# EasyEDA Pro project ProPrj_STM32_Balance_Car.epro

# Schematic Schematic1

## Sheets
1 电源: Board Name: Board1; Create Date: 2025-04-29; Page Name: 电源; Project Name: STM32_Balance_Car; Schematic Name: Schematic1; Update Date: 2025-05-03; Company: 嘉立创EDA; Page Size: A4; Version: V1.0
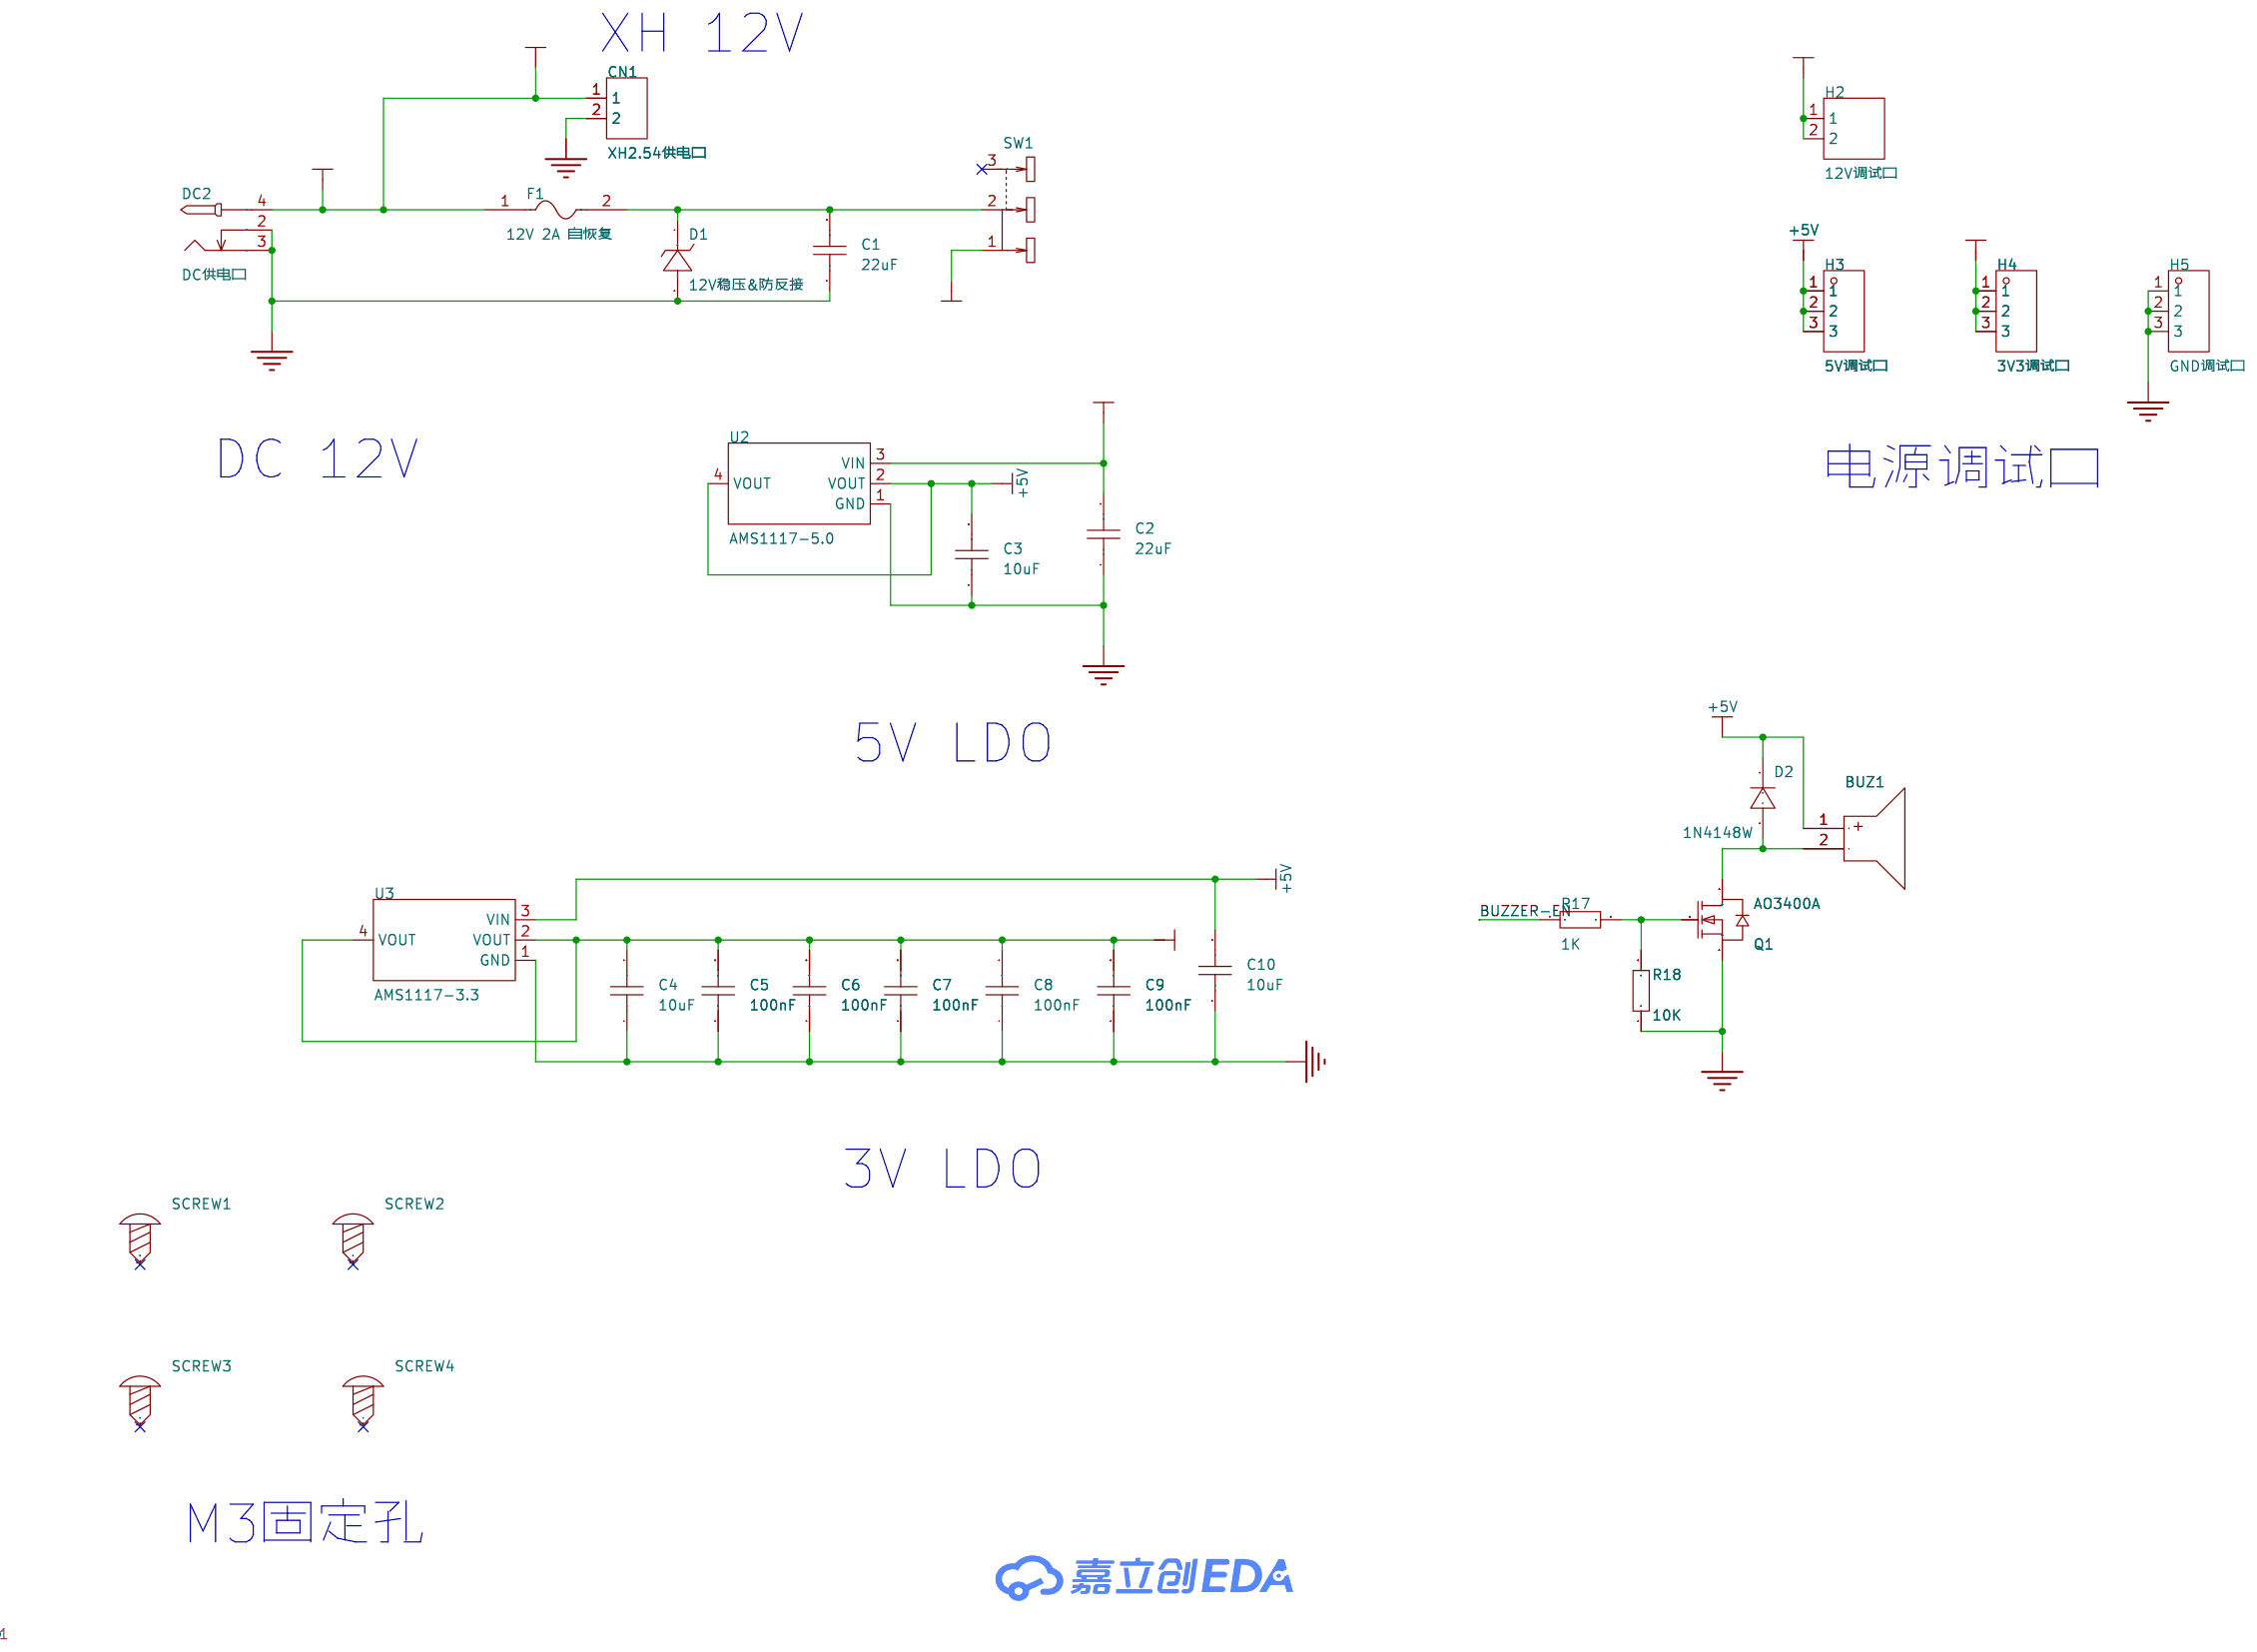
[diagram p0: 电源]
2 MCU: Page Name: MCU
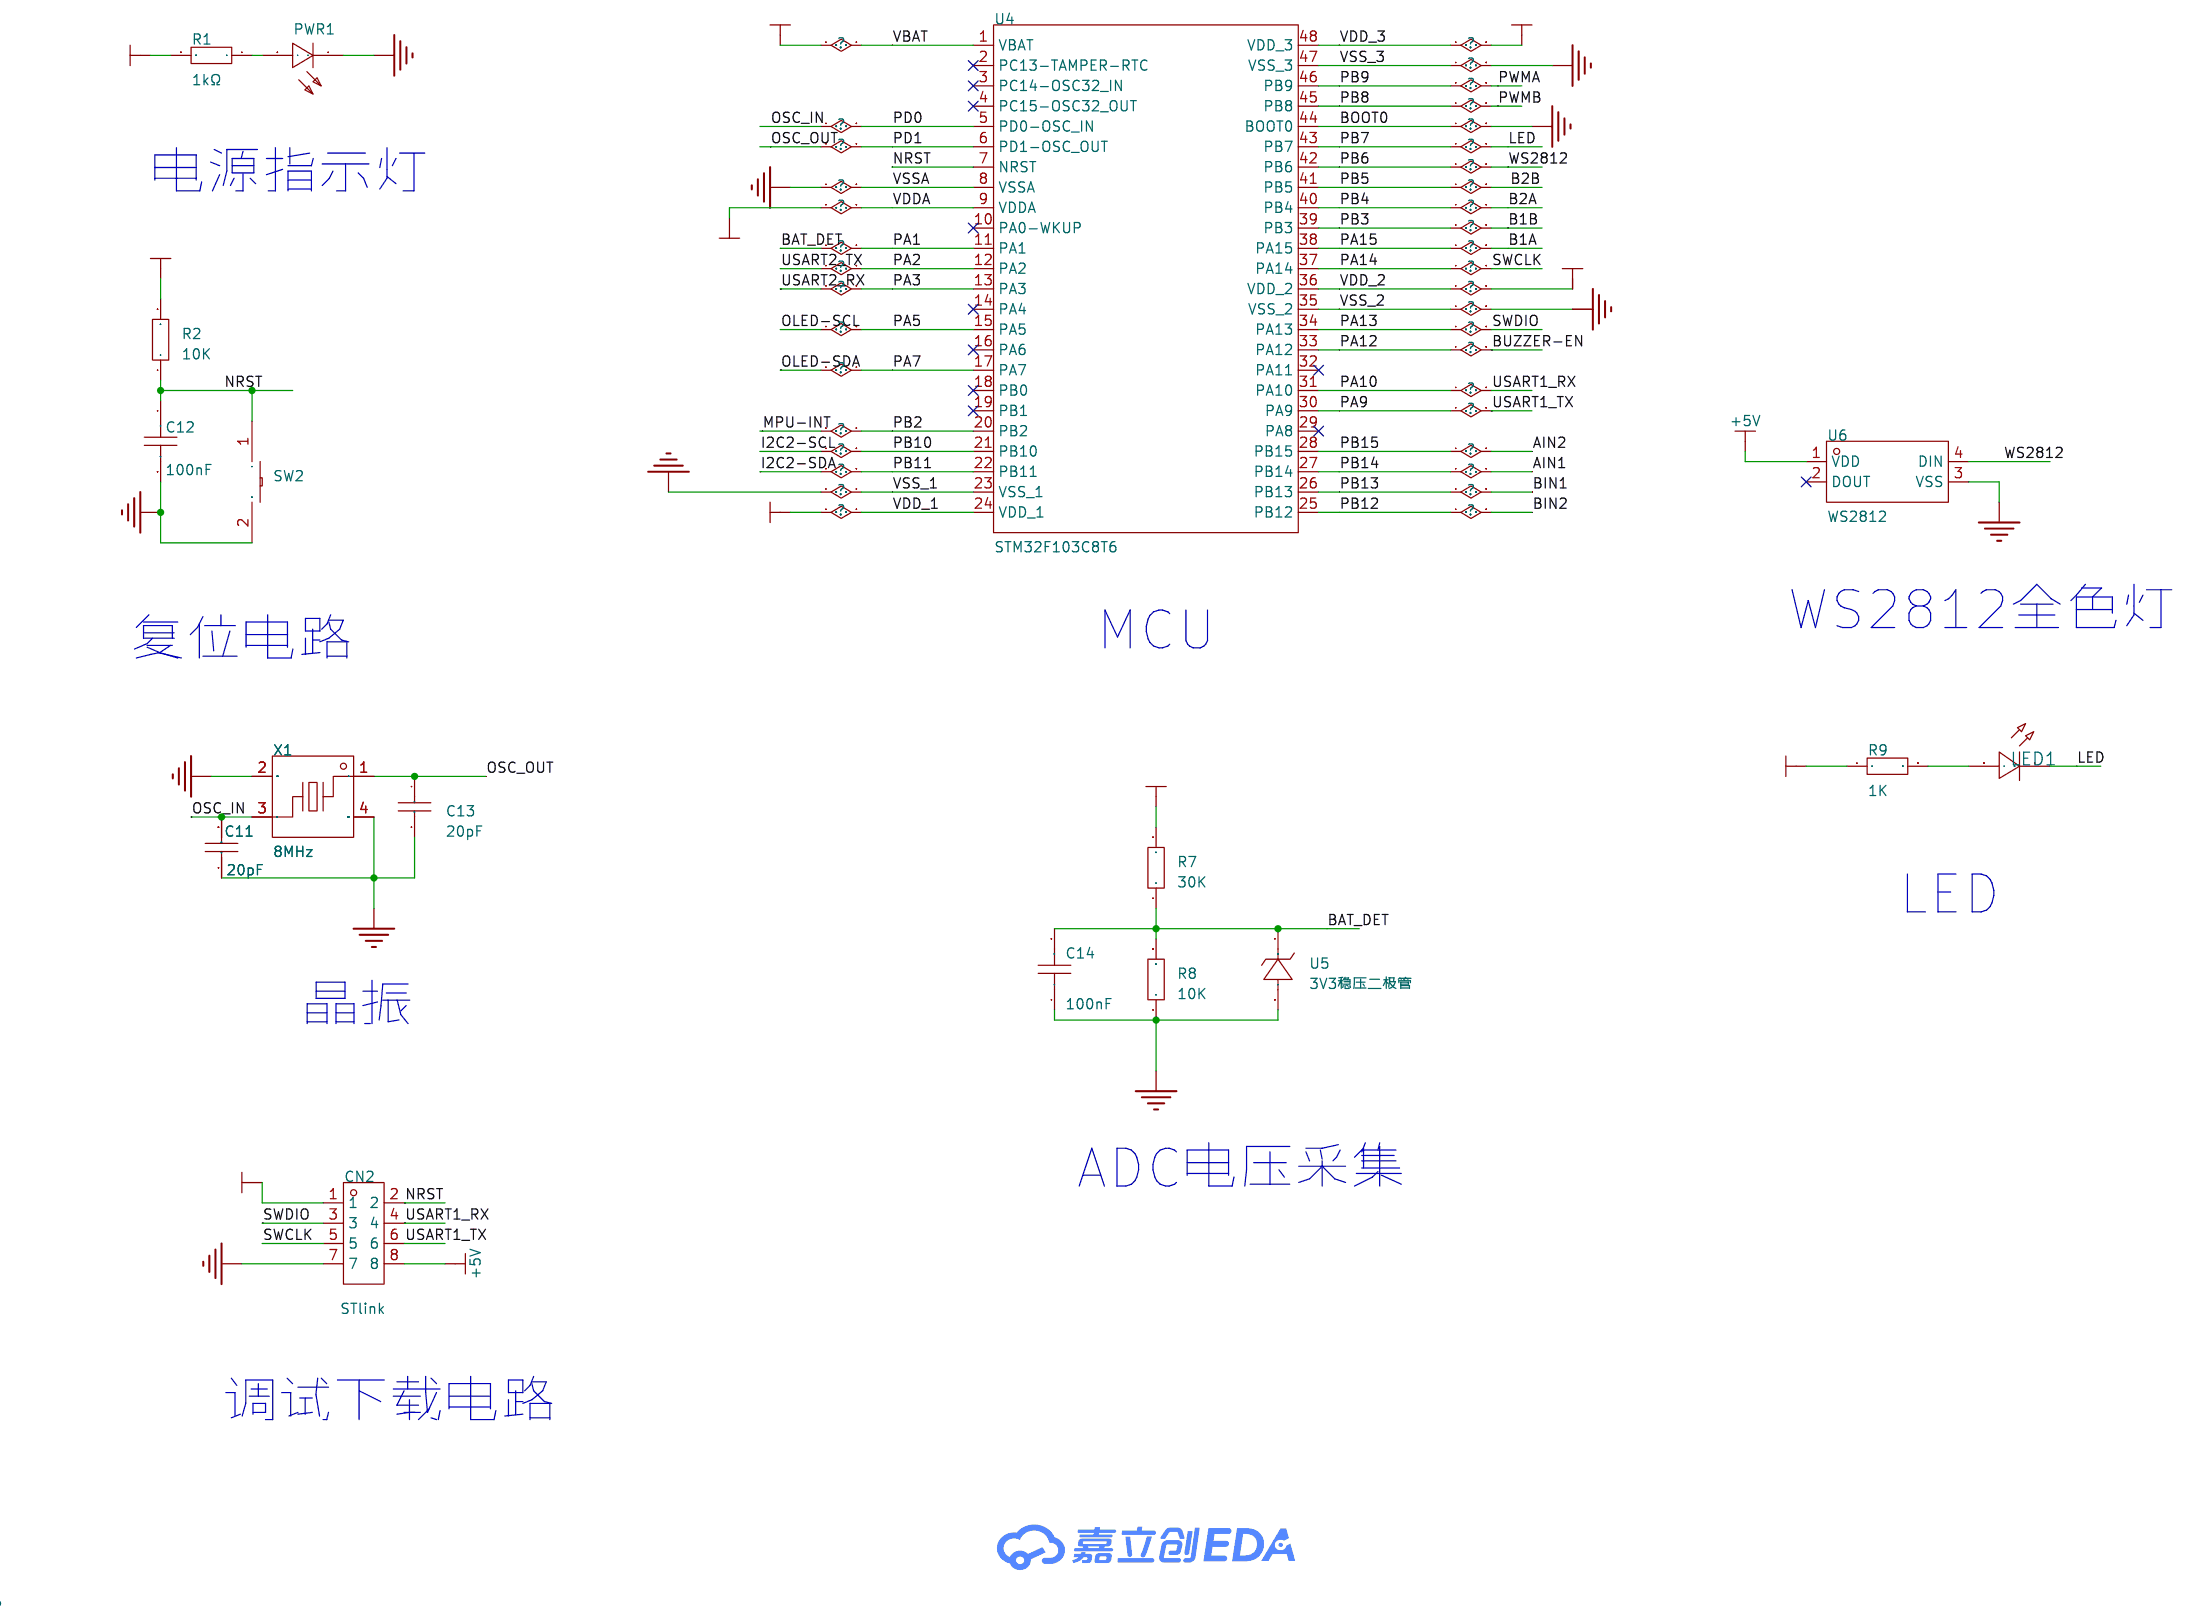
[diagram p1: MCU]
3 电机驱动: Create Date: 2025-04-30; Page Name: 电机驱动; Update Date: 2025-05-04
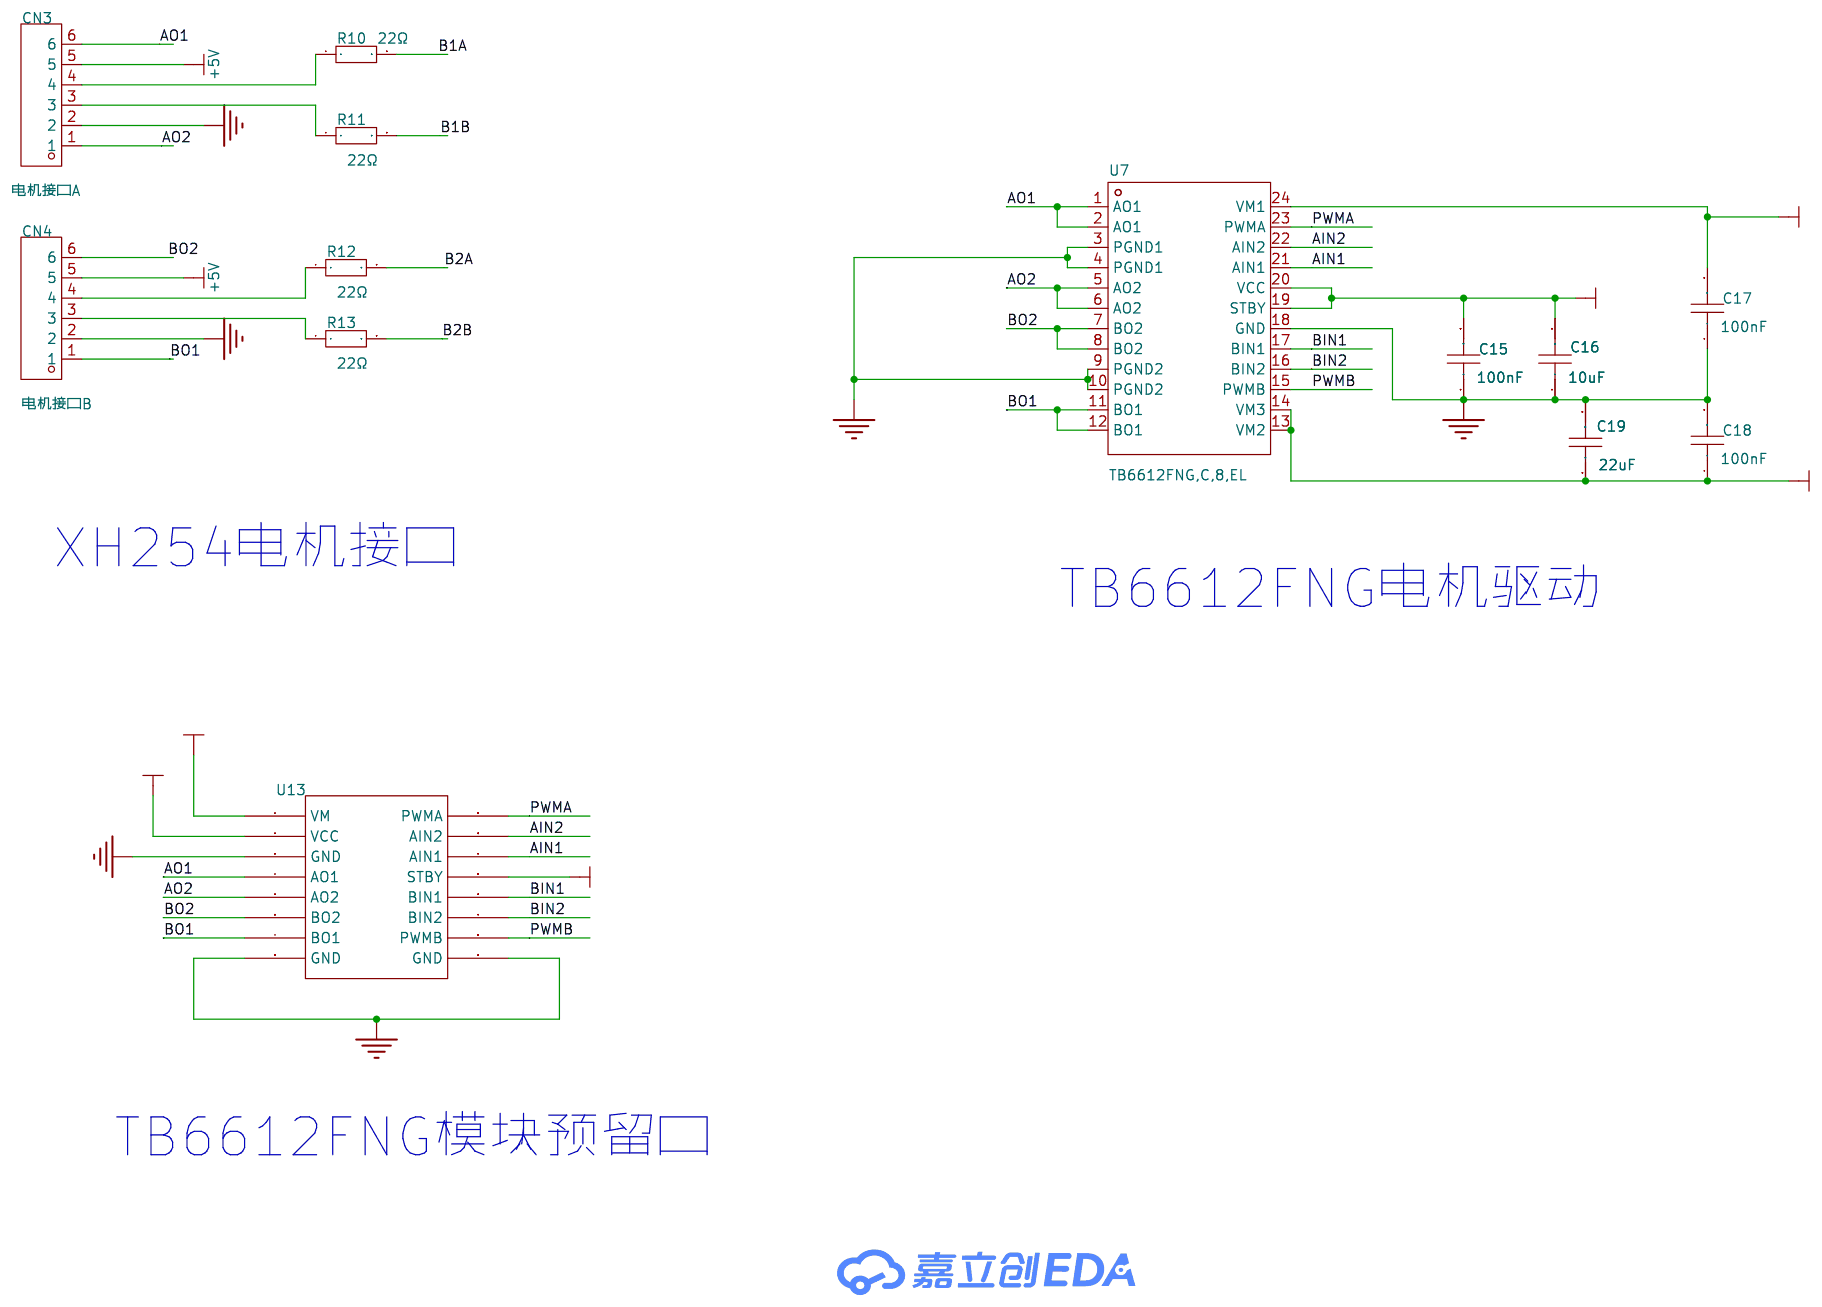
[diagram p2: 电机驱动]
4 MPU6050: Create Date: 2025-05-01; Page Name: MPU6050; Update Date: 2025-05-02
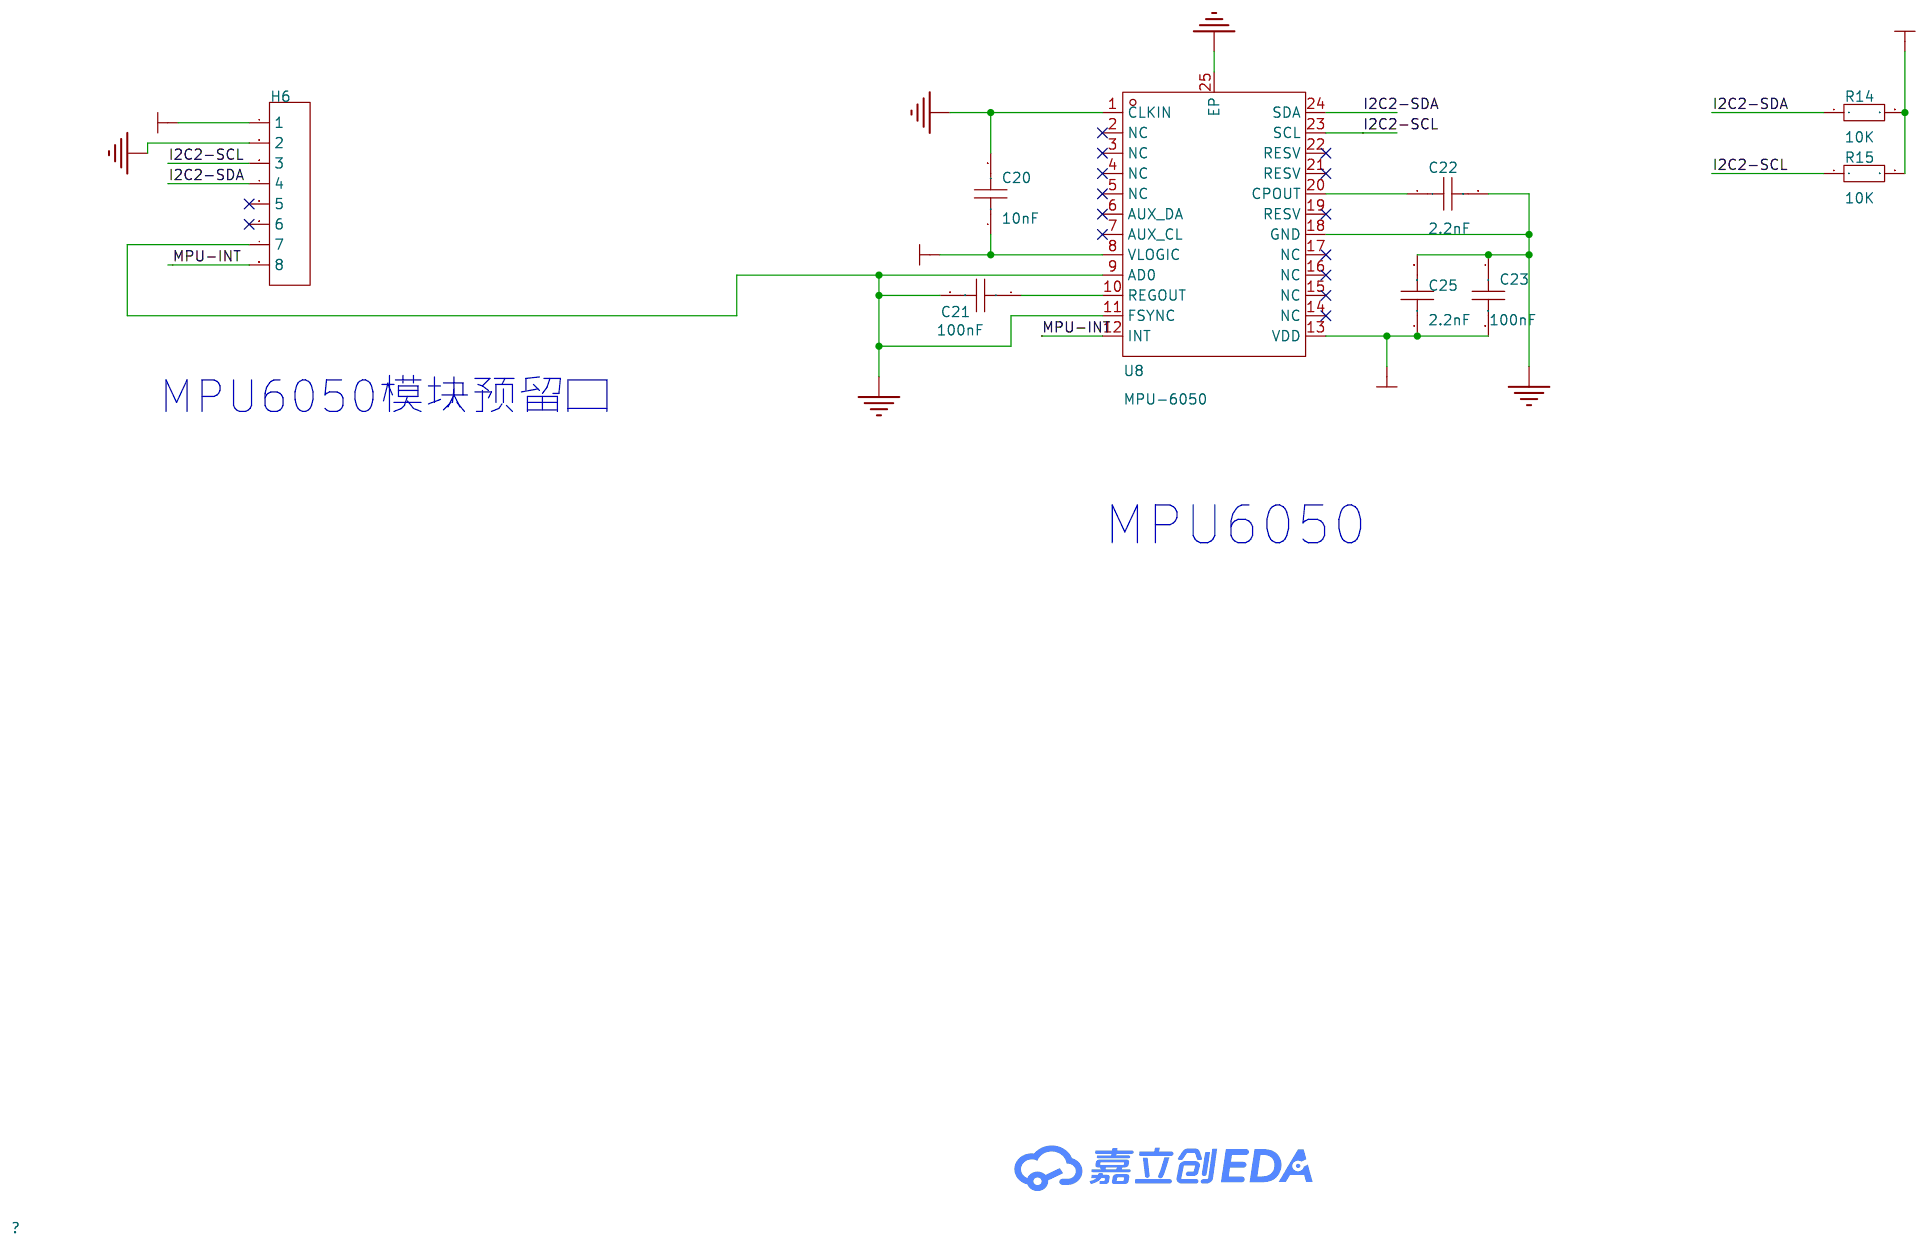
[diagram p3: MPU6050]
5 ECB01C蓝牙: Create Date: 2025-05-01; Page Name: ECB01C蓝牙
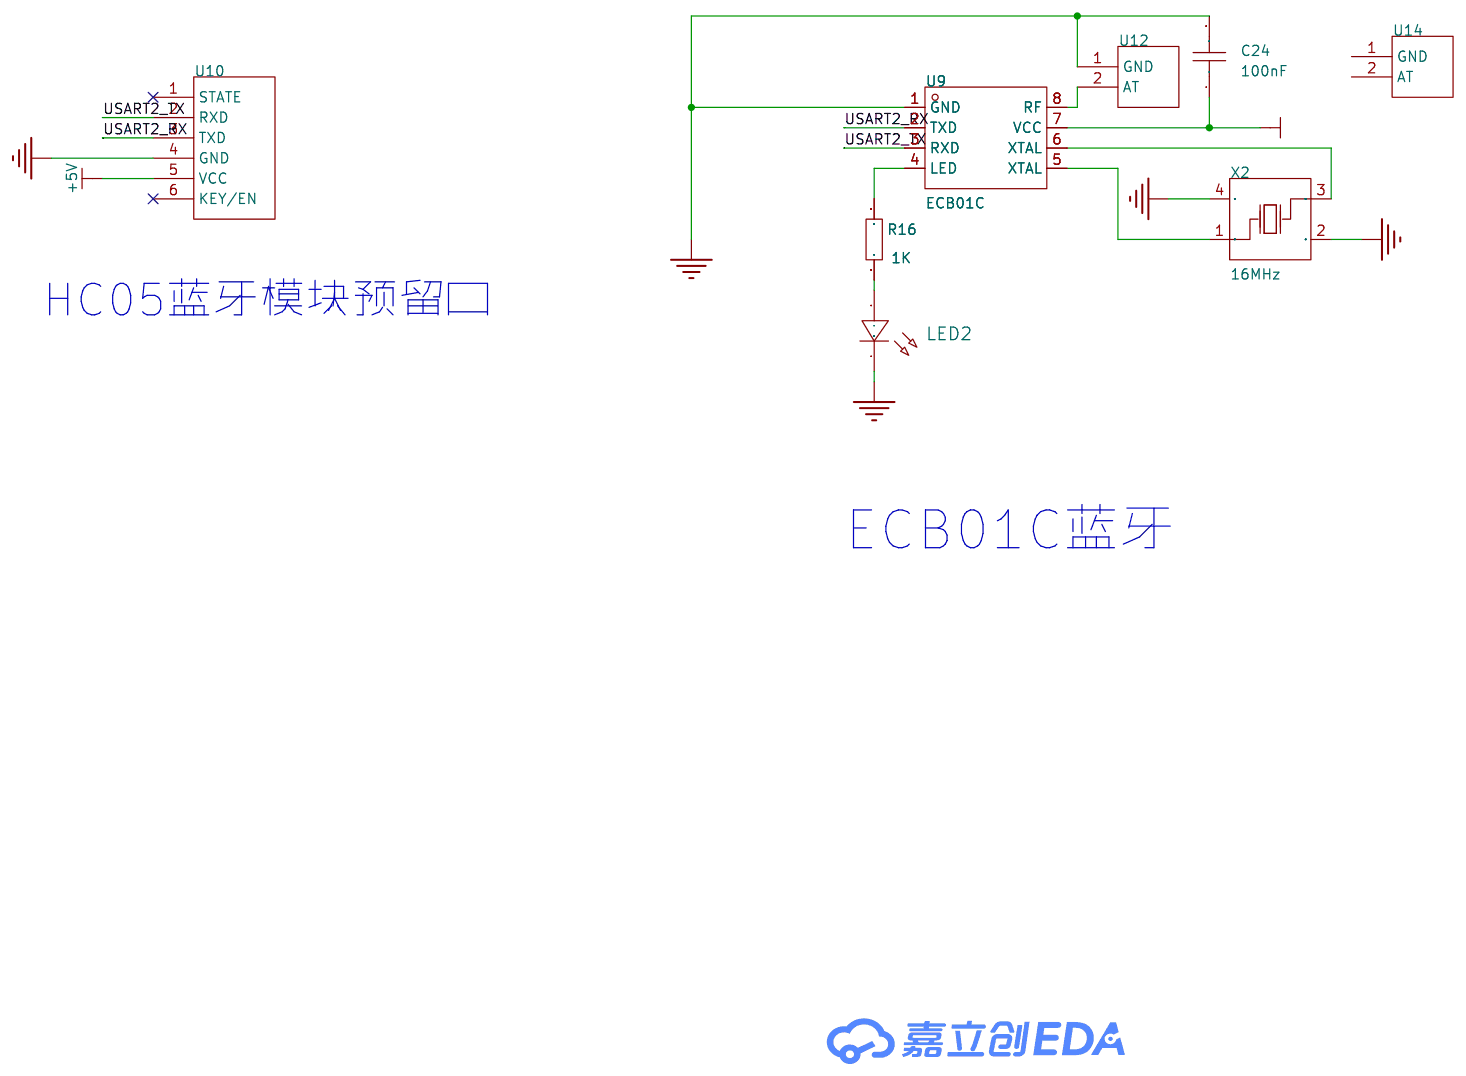
[diagram p4: ECB01C蓝牙]
6 OLED: Create Date: 2025-05-01; Page Name: OLED; Update Date: 2025-05-01
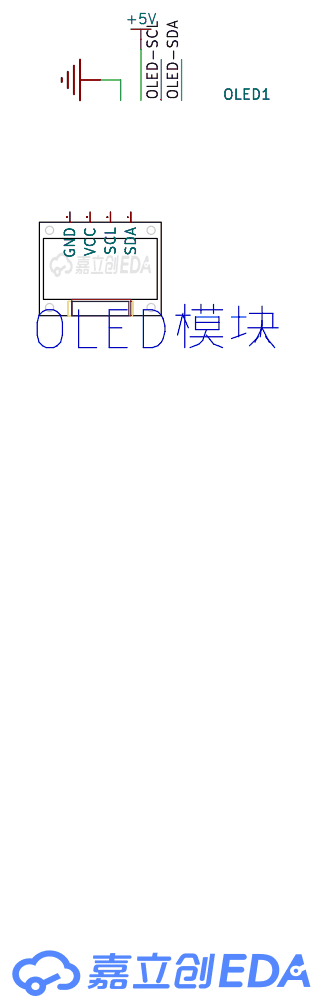
[diagram p5: OLED]

## Parts
sheet ECB01C蓝牙
C24  100nF  [C0603]
LED2  -  [LED_0603]
R16  1K  [R0603]
U9  ECB01C  [SOP-8_L4.9-W3.9-P1.27-LS6.0-BL]
U10  -  [HDR-TH_6P]
U12  -  [ESP32天线]
U14  -  [ESP32天线]
X2  16MHz  [OSC-SMD_4P-L3.2-W2.5-BL]
sheet MCU
C11  20pF  [C0603]
C12  100nF  [C0603]
C13  20pF  [C0603]
C14  100nF  [C0603]
CN2  STlink  [CONN-TH_3111-08RG0BK00T1]
LED1  -  [LED_0603]
PWR1  NCD0603R1  [LED0603-RD_RED]
R1  1kΩ  [R0603]
R2  10K  [R0603]
R7  30K  [R0603]
R8  10K  [R0603]
R9  1K  [R0603]
SW2  TS-1101-C-W  [SW-SMD_L6.0-W3.3-LS8.0]
U4  STM32F103C8T6  [LQFP-48_L7.0-W7.0-P0.50-LS9.0-BL]
U5  3V3稳压二极管  [LL-34_L3.5-W1.5-RD]
U6  WS2812  [LED-SMD_4P-L5.0-W5.0-TL-A]
X1  8MHz  [CRYSTAL-SMD_4P-L3.2-W2.5-BL]
sheet MPU6050
C20  10nF  [C0603]
C21  100nF  [C0603]
C22  2.2nF  [C0603]
C23  100nF  [C0603]
C25  2.2nF  [C0603]
H6  -  [HDR-TH_8P-P2.54-V-F-1]
R14  10K  [R0603]
R15  10K  [R0603]
U8  MPU-6050  [QFN-24_L4.0-W4.0-P0.50-BL-EP2.7]
sheet OLED
OLED1  -  [0.96OLED_4P]
sheet 电机驱动
C15  100nF  [C0603]
C16  10uF  [C0603]
C17  100nF  [C0603]
C18  100nF  [C0603]
C19  22uF  [C0805]
CN3  电机接口A  [CONN-TH_6P-P2.50_ZX-HA2.54-6PWZ-Y]
CN4  电机接口B  [CONN-TH_6P-P2.50_ZX-HA2.54-6PWZ-Y]
R10  22Ω  [R0603]
R11  22Ω  [R0603]
R12  22Ω  [R0603]
R13  22Ω  [R0603]
U7  TB6612FNG,C,8,EL  [SSOP-24_L8.3-W5.6-P0.65-LS7.6-BL]
U13  TB6612模块  [TB6612FNG]
sheet 电源
BUZ1  chenzj1:Buzzer_12x9.5RM6.5  [BUZ-TH_BD12.0-P6.50-D0.6_SEA-1285F]
C1  22uF  [C0805]
C2  22uF  [C0805]
C3  10uF  [C0805]
C4  10uF  [C0805]
C5  100nF  [C0603]
C6  100nF  [C0603]
C7  100nF  [C0603]
C8  100nF  [C0603]
C9  100nF  [C0603]
C10  10uF  [C0805]
CN1  XH2.54供电口  [CONN-TH_2P-P2.50-XH2.54-2P]
D1  12V稳压&防反接  [LL-34_L3.5-W1.5-RD]
D2  1N4148W  [SOD-123F_L2.7-W1.6-LS3.8-RD]
DC2  DC供电口  [DC-2.0]
F1  12V 2A 自恢复  [F1206]
H2  12V调试口  [HDR-TH_2P-P2.54-V-M-1]
H3  5V调试口  [HDR-TH_3P-P2.54-V-M]
H4  3V3调试口  [HDR-TH_3P-P2.54-V-M]
H5  GND调试口  [HDR-TH_3P-P2.54-V-M]
Q1  AO3400A  [SOT-23-3_L2.9-W1.3-P1.90-LS2.4-BR]
R17  1K  [R0603]
R18  10K  [R0603]
SCREW1  -  [M3螺丝]
SCREW2  -  [M3螺丝]
SCREW3  -  [M3螺丝]
SCREW4  -  [M3螺丝]
SW1  SS-12D10L5  [SW-TH_SS-12D10L5]
U2  AMS1117-5.0  [SOT-223_L6.5-W3.5-P2.30-LS7.0-BR]
U3  AMS1117-3.3  [SOT-223-3_L6.5-W3.4-P2.30-LS7.0-BR]

## Library data of the parts
C14-C18 C20-C25 = CAP_0603: Supplier Footprint: 0603
LED1 LED2 = LED_0603-R: Supplier Footprint: 0603
R2 R7-R18 = Res_0603: Supplier Footprint: 0603
U9 = ECB01C: Supplier Part: C9900054098; Supplier Footprint: SOP-8; JLCPCB Part Class: 扩展库; Supplier: LCSC
U10 = HC05
U12 U14 = ESP32天线
X2 = X322516MLB4SI: 晶振类型:贴片晶振;频率:16MHz;常温频差:±10ppm;负载电容:9pF;频率稳定度:±20ppm;; LCSC Part Name: 16MHz ±10ppm 9pF; Supplier Part: C13738; Manufacturer: YXC(扬兴晶振); Supplier Footprint: SMD3225-4P; JLCPCB Part Class: 基础库; Datasheet: https://atta.szlcsc.com/upload/public/pdf/source/20240329/19D5F850207469550BEB00D7DFEDBC7A.pdf; Supplier: LCSC; Type: 贴片晶振; Normal temperature Frequency Tolerance: ±10ppm; Load Capacitance: 9pF; Frequency Stability: ±20ppm; Operating Temperature: -40℃~+85℃
C11 C13 = CL10C200JB8NNNC: 容值:20pF;精度:±5%;额定电压:50V;材质(温度系数):C0G;; LCSC Part Name: 20pF ±5% 50V; Supplier Part: C1648; Manufacturer: SAMSUNG(三星); Supplier Footprint: 0603; JLCPCB Part Class: 基础库; Datasheet: https://atta.szlcsc.com/upload/public/pdf/source/20160218/1457707763339.pdf; Supplier: LCSC; Tolerance: ±5%; Voltage Rated: 50V; Temperature Coefficient: C0G
C12 = CGA0603X7R104K500JT: 容值:100nF;精度:±10%;额定电压:50V;温度系数:X7R;; LCSC Part Name: 100nF ±10% 50V; Supplier Part: C6119867; Manufacturer: HRE(芯声); Supplier Footprint: 0603; JLCPCB Part Class: 扩展库; Datasheet: https://atta.szlcsc.com/upload/public/pdf/source/20250103/C44077DA9E7B3EFAE02F22B6D3D1CBC9.pdf; Supplier: LCSC; Tolerance: ±10%; Voltage Rating: 50V; Temperature Coefficient: X7R
CN2 = 3111-08RG0BK00T1: 连接器类型:简牛座;间距:2mm;结构:2x4P;封装形式:弯插;行距:2mm;排数:2;每排PIN数:4;触头材质:黄铜;触头镀层:金;; LCSC Part Name: 2mm 2x4P 排数:2 每排P数:4; Supplier Part: C720751; Manufacturer: Wcon(维峰电子); Supplier Footprint: 弯插,P=2mm; JLCPCB Part Class: 扩展库; Datasheet: https://atta.szlcsc.com/upload/public/pdf/source/20200908/C720751_429ECEF3D5B5C4289EC4F86089830CA0.pdf; Supplier: LCSC; Connector Type: 简牛座; Pitch: 2mm; Structure: 2x4P; Holder Type: 弯插; Row Spacing: 2mm; Number of Rows: 2; Pin Number in each Row: 4; Contact Material: 黄铜; Contact Plating: 金
PWR1 = NCD0603R1_C84263: 灯头类型:-;发光颜色:红色;正向压降(Vf):1.6V~2.6V;功率:65mW;正向电流:25mA;波长:615nm~630nm;二极管配置:独立二极管;透镜颜色:-;色温:-;发光强度:80mcd~220mcd;发光角度:130°;载带方式:-;工作温度:-30℃~+85℃;; Supplier Part: C84263; Manufacturer: 国星光电; Supplier Footprint: 0603; JLCPCB Part Class: 扩展库; Datasheet: https://atta.szlcsc.com/upload/public/pdf/source/20200820/C84263_DABC6A75E58F576973B407FDBA283D60.pdf; Supplier: LCSC; Illumination Color: 红色; Voltage - Forward(Vf): 1.6V~2.6V; Power(Watts): 65mW; Forward Current: 25mA; Wavelength - Dominant: 615nm~630nm; Diode Configuration: 独立二极管; Luminous Intensity: 80mcd~220mcd; Viewing Angle: 130°; Operating Temperature: -30℃~+85℃
R1 = 0603WAF1001T5E: 电阻类型:厚膜电阻;阻值:1kΩ;精度:±1%;功率:100mW;最大工作电压:75V;温度系数:±100ppm/℃;; LCSC Part Name: 1kΩ ±1% 100mW 厚膜电阻; Supplier Part: C21190; Manufacturer: UNI-ROYAL(厚声); Supplier Footprint: 0603; JLCPCB Part Class: 基础库; Datasheet: https://atta.szlcsc.com/upload/public/pdf/source/20200306/C422600_1E6D84923E4A46A82E41ADD87F860B5C.pdf; Supplier: LCSC; Type: 厚膜电阻; Tolerance: ±1%; Power(Watts): 100mW; Overload Voltage (Max): 75V; Temperature Coefficient: ±100ppm/℃; Operating Temperature Range: -55℃~+155℃
SW2 = TS-1101-C-W: 电路结构:单刀单掷;按钮形状:矩形按钮;作用力:260gf;安装方式:立贴;开关长度:6mm;开关宽度:3.6mm;开关高度:2.5mm;带支架:不带;触点电流:50mA;额定电压(AC):-;额定电压(DC):12V;额定功率:-;绝缘电阻:-;带灯:无;机械寿命:5万次;; LCSC Part Name: 6*3.6*2.5mm 立贴 轻触开关; Supplier Part: C318938; Manufacturer: XKB Connectivity(中国星坤); Supplier Footprint: SMD; JLCPCB Part Class: 扩展库; Datasheet: https://atta.szlcsc.com/upload/public/pdf/source/20200227/C318938_C2E53B1EEDE37D980A33616AC086DE53.pdf; Supplier: LCSC; Circuit: 单刀单掷; Actuator Style: 矩形按钮; Operating Force: 260gf; Mounting Style: 立贴; Switch Length: 6mm; Switch Width: 3.6mm; Switch Height: 2.5mm; Strike Gundam: 不带; Contact Current: 50mA; Voltage Rating (DC): 12V; Actuator/Cap Color: 白色带淡绿; With Lamp: 无; Mechanical Life: 5万次; Operating Temperature: -30℃~+85℃
U4 = STM32F103C8T6: CPU内核:ARM-M3;CPU最大主频:72MHz;应用领域:-;; LCSC Part Name: 主流增强型ARM Cortex-M3 MCU，具有64 KB Flash、72 MHz CPU、电机控制、USB和CAN; Supplier Part: C8734; Manufacturer: ST(意法半导体); Supplier Footprint: LQFP-48(7x7); JLCPCB Part Class: Extended Part; Datasheet: https://atta.szlcsc.com/upload/public/pdf/source/20220812/8363ACEC51AD55ECEB84799464F7CB85.pdf; Supplier: LCSC; CPU Core: ARM-M3; CPU Maximum Speed: 72MHz; Program Storage Size: 64KB; Program Memory Type: FLASH; Number of I/O: 37; ADC (Bit): 12bit; Low Voltage Detection Threshold: 2V~3.6V
D1 U5 = 稳压二极管: Supplier Part: C9900043677; Supplier Footprint: LL34; JLCPCB Part Class: 扩展库; Supplier: LCSC
U6 = WS2812: RGB三色灯珠，5050RGB集成光源内置IC幻彩灯珠单点单控5V，高性价比，12mA; Supplier Part: C42417498; Manufacturer: worldsemi; Supplier Footprint: SMD5050-4P; Datasheet: https://atta.szlcsc.com/upload/public/pdf/source/20241220/DE49FA134DE3BC32DD41246C16D24E19.pdf; Supplier: LCSC
X1 = X32258MSB4SI: 晶振类型:贴片晶振;频率:8MHz;常温频差:±10ppm;负载电容:20pF;频率稳定度:±20ppm;; LCSC Part Name: 8MHz ±10ppm 20pF; Supplier Part: C2682774; Manufacturer: YXC(扬兴晶振); Supplier Footprint: SMD3225-4P; JLCPCB Part Class: 扩展库; Datasheet: https://atta.szlcsc.com/upload/public/pdf/source/20240329/19D5F850207469550BEB00D7DFEDBC7A.pdf; Supplier: LCSC; Type: 贴片晶振; Normal temperature Frequency Tolerance: ±10ppm; Load Capacitance: 20pF; Frequency Stability: ±20ppm; Operating Temperature: -40℃~+85℃
H6 = HDR-F_2.54_1x8P: Supplier Part: C27438; Supplier Footprint: 插件
U8 = MPU-6050: 传感器类型:加速度计陀螺仪;; Supplier Part: C24112; Manufacturer: TDK InvenSense(应美盛); Supplier Footprint: QFN-24-EP(4x4); JLCPCB Part Class: 扩展库; Datasheet: https://atta.szlcsc.com/upload/public/pdf/source/20140425/1457707046159.pdf; Supplier: LCSC; Sensor Type: 加速度计陀螺仪; Operating Temperature: -40℃~+85℃
OLED1 = 0.96OLED模块_4P: Supplier Footprint: 插件
C1-C10 C19 = CAP_0805: Supplier Footprint: 0805
CN3 CN4 = WAFER-XH2.54-6PWZ-H62: 插针结构:1x6P;间距:2.5mm;安装方式:弯插;参考系列:XH;总PIN数:6P;排数:1;每排PIN数:6;行距:-;额定电流:3A;触头材质:铜合金;触头镀层:锡;工作温度:-25℃~+85℃;; LCSC Part Name: 1x6P 间距:2.5mm 弯插 系列:XH; Supplier Part: C22390476; Manufacturer: XUNPU(讯普); Supplier Footprint: 弯插,P=2.54mm; JLCPCB Part Class: 扩展库; Datasheet: https://atta.szlcsc.com/upload/public/pdf/source/20240428/E7FD5098358032A2B7AE6E057C1D3765.pdf; Supplier: LCSC; Pins Structure: 1x6P; Pitch: 2.5mm; Mounting Type: 弯插; Reference Series: XH; Number of Pins: 6P; Number of Rows: 1; Number of PINs Per Row: 6; Current Rating: 3A; Contact Material: 铜合金; Contact Plating: 锡; Operating Temperature: -25℃~+85℃; Voltage Rating: 250V; Plastic Material: PA66; Flame Retardant Rating: UL94V-2; Color: 黄色; Z-Height of the Board: 5.75mm; X-Length of Bottom Edge on Board (Spacing Line): 17.5mm; Y-Width of Bottom Edge on Board: 7.17mm
U7 = TB6612FNG,C,8,EL: LCSC Part Name: 1A 有刷直流电机驱动芯片 5.5V; Supplier Part: C141517; Manufacturer: TOSHIBA(东芝); Supplier Footprint: SSOP-24; JLCPCB Part Class: 扩展库; Datasheet: https://atta.szlcsc.com/upload/public/pdf/source/20171128/C141517_15118625624231147036.pdf; Supplier: LCSC
U13 = TB6612模块: TB6612FNG电机驱动板模块
BUZ1 = chenzj1:Buzzer_12x9.5RM6.5: Supplier Part: C9900008742; Supplier Footprint: Buzzer; JLCPCB Part Class: 扩展库; Supplier: LCSC
CN1 = XH2.54*2P_直插: Supplier Part: C9900008615; Supplier Footprint: XH2.54_2P; JLCPCB Part Class: 扩展库; Supplier: LCSC
D2 = 1N4148W_C81598: 二极管配置:独立式;正向压降(Vf):1V@50mA;直流反向耐压(Vr):75V;整流电流:150mA;反向恢复时间(trr):4ns;; Supplier Part: C81598; Manufacturer: ST(先科); Supplier Footprint: SOD-123; JLCPCB Part Class: 基础库; Datasheet: https://atta.szlcsc.com/upload/public/pdf/source/20161024/1477288446905.pdf; Supplier: LCSC; Diode Configuration: 独立式; Forward Voltage (Vf@If): 1V@50mA; Reverse Voltage (Vr): 75V; Rectified Current: 150mA; Reverse Leakage Current (Ir): 1uA@75V; Reverse Recovery Time (trr): 4ns
DC2 = DC-005_2.0: Supplier Footprint: 插件
F1 = PPTCNANOSMDC075F-20.75A6V: Supplier Part: C9900014746; JLCPCB Part Class: 扩展库; Supplier: LCSC
H2 = HDR-M_2.54_1x2P: Supplier Part: C124375; Supplier Footprint: 插件
H3-H5 = HDR-M_2.54_1x3P: Supplier Part: C2937625; Supplier Footprint: 插件
Q1 = AO3400A_C347475: 类型:1个N沟道;漏源电压(Vdss):30V;连续漏极电流(Id):5.8A;导通电阻(RDS(on)@Vgs,Id):28mΩ@10V,5.8A;功率(Pd):1.4W;阈值电压(Vgs(th)@Id):1.4V@250uA;; LCSC Part Name: 1个N沟道 耐压:30V 电流:5.8A; Supplier Part: C347475; Manufacturer: UMW(友台半导体); Supplier Footprint: SOT-23; JLCPCB Part Class: 扩展库; Datasheet: https://atta.szlcsc.com/upload/public/pdf/source/20231109/50AB4FB4D66E55864F9B8D027B723C9A.pdf; Supplier: LCSC; Type: 1个N沟道; Drain Source Voltage (Vdss): 30V; Continuous Drain Current (Id): 5.8A; Drain Source On Resistance (RDS(on)@Vgs,Id): 28mΩ@10V,5.8A; Power Dissipation (Pd): 1.4W; Gate Threshold Voltage (Vgs(th)@Id): 1.4V@250uA; Total Gate Charge (Qg@Vgs): 12nC@10V; Input Capacitance (Ciss@Vds): 1.05nF@24V; Reverse Transfer Capacitance (Crss@Vds): 77pF@15V; Operating Temperature: -55℃~+150℃
SCREW1-SCREW4 = M3螺丝: Supplier Footprint: 插件
SW1 = SS-12D10L5: 电路结构:单刀双掷;安装方式:直插;开关颜色:黑色;额定电流(DC):3A;额定电压(DC):125V;额定电流(AC):3A;额定电压(AC):125V;机械寿命:1万次;; LCSC Part Name: 柄长5mm 直插双档 滑动开关; Supplier Part: C319012; Manufacturer: XKB Connectivity(中国星坤); Supplier Footprint: 插件; JLCPCB Part Class: 扩展库; Datasheet: https://atta.szlcsc.com/upload/public/pdf/source/20211009/D6412F37AABE6F9459A6EE7FA4DAEADB.pdf; Supplier: LCSC; Circuit: 单刀双掷; Actuator Style: 矩形柱状; Pin Style: PC引脚; Switch Length: 13mm; Switch Width: 6.8mm; Switch Height: 6.4mm; Mounting Style: 直插; Actuator Color: 黑色; Current Rating (DC): 3A; Voltage Rating (DC): 125V; Current Rating (AC): 3A; Voltage Rating (AC): 125V; Mechanical Life: 1万次; Operating Temperature: -40℃~+85℃
U2 = AMS1117-5.0_C6187: 输出类型:固定;工作电压:12V;输出电压:5V;输出电流:1A;电源纹波抑制比(PSRR):-;输出极性:正极;; LCSC Part Name: 输入12V 输出5V 1A; Supplier Part: C6187; Manufacturer: AMS; Supplier Footprint: SOT-223; JLCPCB Part Class: 基础库; Datasheet: https://atta.szlcsc.com/upload/public/pdf/source/20230918/E4B716057EE82179D88E8A0894830D59.pdf; Supplier: LCSC; Output Type: 固定; Voltage - Supply: 12V; Output Voltage: 5V; Output Current: 1A; Voltage Dropout: 1.3V@(1A); Features: 过流保护(OCP); Output Configuration: 正极; Number of Outputs: 1
U3 = AMS1117-3.3_C6186: 输出类型:固定;工作电压:-;输出电压:3.3V;输出电流:1A;电源纹波抑制比(PSRR):72dB@(120Hz);输出极性:正极;; LCSC Part Name: 输出3.3V 1A; Supplier Part: C6186; Manufacturer: AMS; Supplier Footprint: SOT-223; JLCPCB Part Class: 基础库; Datasheet: https://atta.szlcsc.com/upload/public/pdf/source/20180727/C6186_7A095716F0823C02F1997A905E26C086.pdf; Supplier: LCSC; Output Type: 固定; Output Voltage: 3.3V; Output Current: 1A; Power Supply Rejection Ratio (PSRR): 72dB@(120Hz); Voltage Dropout: 1.3V@(800mA); Features: 过流保护(OCP)；热关断(TSD); Output Configuration: 正极; Number of Outputs: 1

## Nets
3V3: C4.2 C5.2 C6.2 C7.2 C8.2 C9.2 C15.2 C16.2 C20.1 C23.2 C24.1 C25.1 CN2.1 H4.1 H4.2 H4.3 H6.1 R1.2 R2.2 R9.1 R14.2 R15.2 U3.2(VOUT) U3.4(VOUT) U4.1(VBAT) U4.9(VDDA) U4.24(VDD_1) U4.36(VDD_2) U4.48(VDD_3) U7.19(STBY) U7.20(VCC) U8.8(VLOGIC) U8.13(VDD) U9.7(VCC) U13.2(VCC) U13.12(STBY)
+5V: BUZ1.1(+) C3.2 C10.2 CN2.8 CN3.5 CN4.5 D2.1(K) H3.1 H3.2 H3.3 U2.2(VOUT) U2.4(VOUT) U3.3(VIN) U6.1(VDD) U10.5(VCC)
+12V: CN1.1 DC2.4 F1.1 H2.1 H2.2
GND: C1.1 C2.1 C3.1 C4.1 C5.1 C6.1 C7.1 C8.1 C9.1 C10.1 C11.1 C12.2 C13.2 C14.1 C15.1 C16.1 C17.1 C18.2 C19.2 C20.2 C21.2 C22.2 C23.1 C24.2 C25.2 CN1.2 CN2.7 CN3.2 CN4.2 D1.2(A) DC2.2 DC2.3 H5.1 H5.2 H5.3 H6.2 H6.7 LED2.1(C) PWR1.1(K) Q1.2(S) R8.1 R18.1 SW2.2 U2.1(GND) U3.1(GND) U4.8(VSSA) U4.23(VSS_1) U4.35(VSS_2) U4.44(BOOT0) U4.47(VSS_3) U5.2(A) U6.3(VSS) U7.3(PGND1) U7.4(PGND1) U7.9(PGND2) U7.10(PGND2) U7.18(GND) U8.1(CLKIN) U8.9(AD0) U8.11(FSYNC) U8.18(GND) U8.25(EP) U9.1(GND) U10.4(GND) U12.1(GND) U13.3(GND) U13.8(GND) U13.16(GND) X1.2(GND) X1.4(GND) X2.2(GND) X2.4(GND)
VIN_12V: C2.2 C17.2 C18.1 C19.1 R7.2 SW1.1 U2.3(VIN) U7.13(VM2) U7.14(VM3) U7.24(VM1) U13.1(VM)
AIN1: U4.27(PB14) U7.21(AIN1) U13.11(AIN1)
AIN2: U4.28(PB15) U7.22(AIN2) U13.10(AIN2)
AO1: CN3.6 U7.1(AO1) U7.2(AO1) U13.4(AO1)
AO2: CN3.1 U7.5(AO2) U7.6(AO2) U13.5(AO2)
B1A: R10.2 U4.38(PA15)
B1B: R11.2 U4.39(PB3)
B2A: R12.2 U4.40(PB4)
B2B: R13.2 U4.41(PB5)
BAT_DET: C14.2 R7.1 R8.2 U4.11(PA1) U5.1(C)
BIN1: U4.26(PB13) U7.17(BIN1) U13.13(BIN1)
BIN2: U4.25(PB12) U7.16(BIN2) U13.14(BIN2)
BO1: CN4.1 U7.11(BO1) U7.12(BO1) U13.7(BO1)
BO2: CN4.6 U7.7(BO2) U7.8(BO2) U13.6(BO2)
BUZZER-EN: R17.1 U4.33(PA12)
I2C2-SCL: H6.3 R15.1 U4.21(PB10) U8.23(SCL)
I2C2-SDA: H6.4 R14.1 U4.22(PB11) U8.24(SDA)
LED: LED1.1(C) U4.43(PB7)
MPU-INT: H6.8 U4.20(PB2) U8.12(INT)
NRST: C12.1 CN2.2 R2.1 SW2.1 U4.7(NRST)
OLED-SCL: U4.15(PA5)
OLED-SDA: U4.17(PA7)
OSC_IN: C11.2 U4.5(PD0-OSC_IN) X1.3
OSC_OUT: C13.1 U4.6(PD1-OSC_OUT) X1.1
PA2: U4.12(PA2) U9.3(RXD) U10.2(RXD)
PA3: U4.13(PA3) U9.2(TXD) U10.3(TXD)
PA9: CN2.6 U4.30(PA9)
PA10: CN2.4 U4.31(PA10)
PA13: CN2.3 U4.34(PA13)
PA14: CN2.5 U4.37(PA14)
PB6: U4.42(PB6) U6.4(DIN)
PB8: U4.45(PB8) U7.15(PWMB) U13.15(PWMB)
PB9: U4.46(PB9) U7.23(PWMA) U13.9(PWMA)
$1N4253: C1.2 D1.1(C) F1.2 SW1.2
$1N5616: Q1.1(G) R17.2 R18.2
$1N5651: BUZ1.2(-) D2.2(A) Q1.3(D)
$2N1115: PWR1.2(A) R1.1
$2N2795: LED1.2(A) R9.2
$4N663: C21.1 U8.10(REGOUT)
$4N779: C22.1 U8.20(CPOUT)
$5N416: LED2.2(A) R16.1
Net-(CN3-3): CN3.3 R11.1
Net-(CN3-4): CN3.4 R10.1
Net-(CN4-3): CN4.3 R13.1
Net-(CN4-4): CN4.4 R12.1
Net-(R16-2): R16.2 U9.4(LED)
Net-(U9-5): U9.5(XTAL) X2.1(OSC1)
Net-(U9-6): U9.6(XTAL) X2.3(OSC2)
Net-(U9-8): U9.8(RF) U12.2(AT)

Not connected (* = marked no-connect by the designer): H6 5* 6*; OLED1 1(GND) 2(VCC) 3(SCL) 4(SDA); SCREW1 1*; SCREW2 1*; SCREW3 1*; SCREW4 1*; SW1 3*; U4 2(PC13-TAMPER-RTC)* 3(PC14-OSC32_IN)* 4(PC15-OSC32_OUT)* 10(PA0-WKUP)* 14(PA4)* 16(PA6)* 18(PB0)* 19(PB1)* 29(PA8)* 32(PA11)*; U6 2(DOUT)*; U8 2(NC)* 3(NC)* 4(NC)* 5(NC)* 6(AUX_DA)* 7(AUX_CL)* 14(NC)* 15(NC)* 16(NC)* 17(NC)* 19(RESV)* 21(RESV)* 22(RESV)*; U10 1(STATE)* 6(KEY/EN)*; U14 1(GND) 2(AT)

## Notes on the sheets
sheet 1
- XH 12V
- DC 12V
- 电源调试口
- 5V LDO
- 3V LDO
- M3固定孔
sheet 2
- 电源指示灯
- WS2812全色灯
- MCU
- 复位电路
- LED
- 晶振
- ADC电压采集
- 调试下载电路
sheet 3
- XH254电机接口
- TB6612FNG电机驱动
- TB6612FNG模块预留口
sheet 4
- MPU6050模块预留口
- MPU6050
sheet 5
- HC05蓝牙模块预留口
- ECB01C蓝牙
sheet 6
- OLED模块

# Board PCB
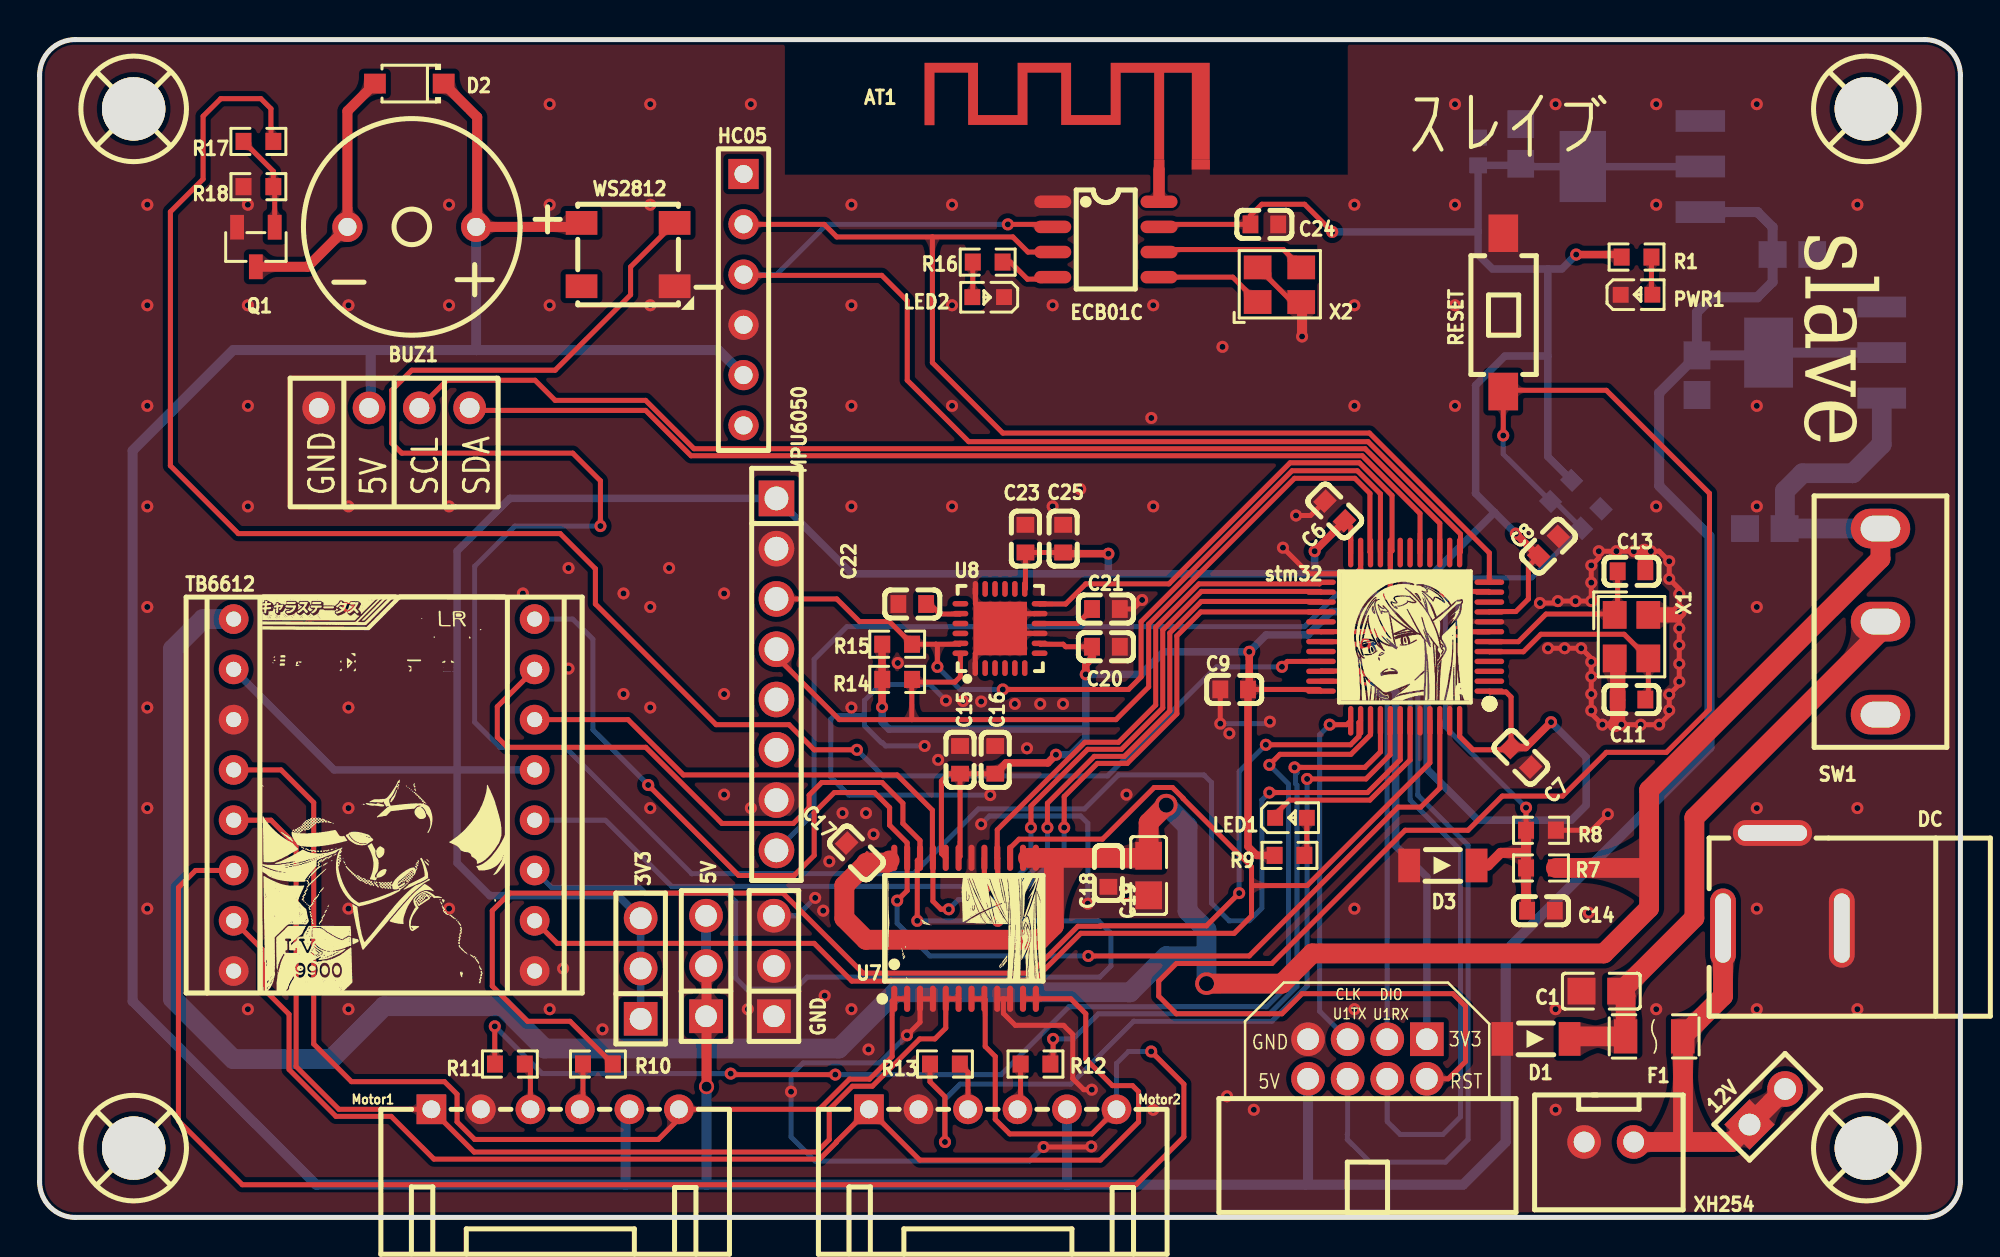
[diagram p6: board, top side]
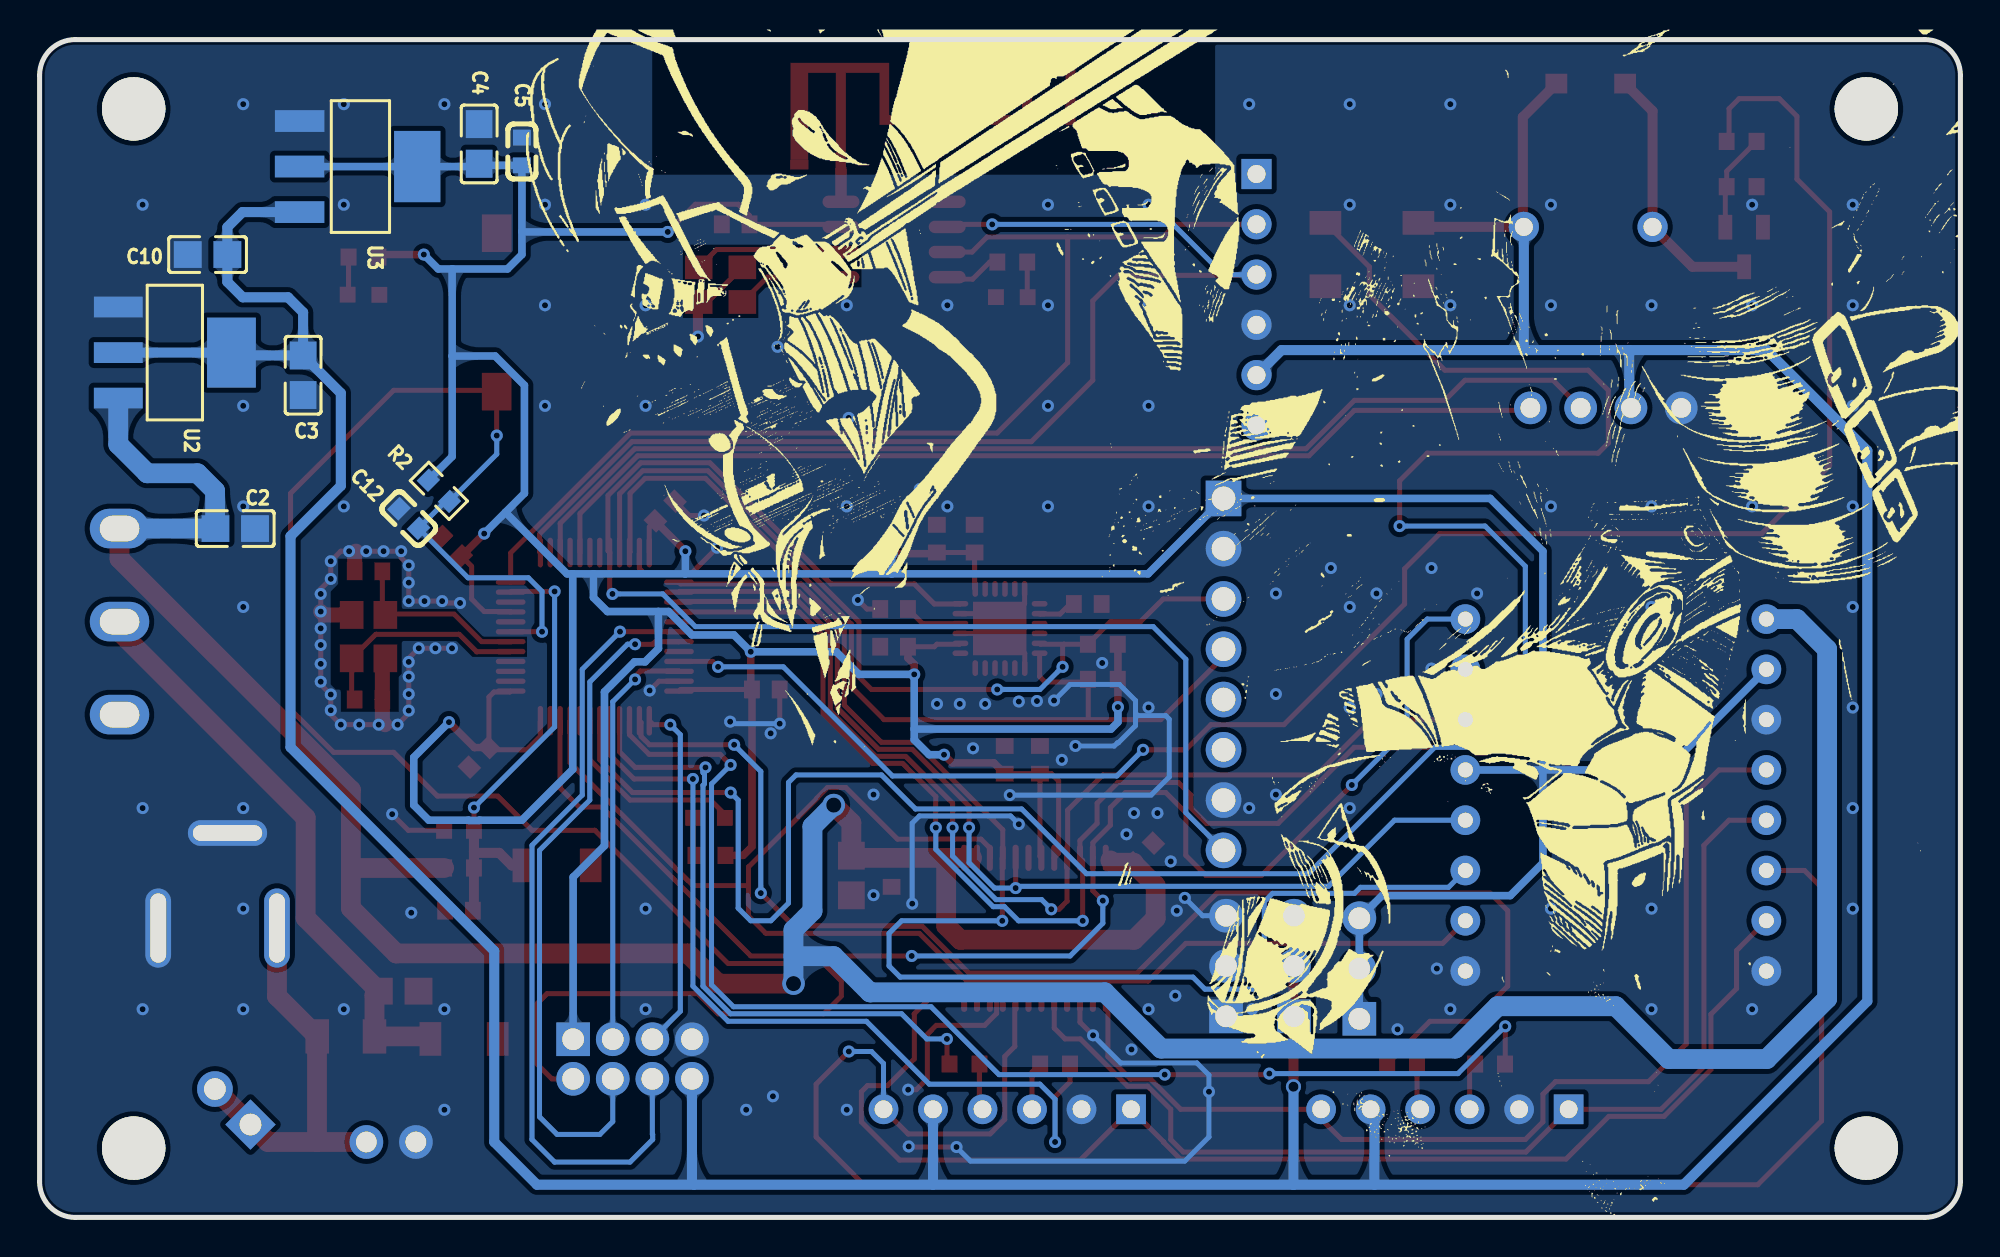
[diagram p7: board, bottom side, seen from below]

Outline 97 x 59.5 mm; copper layers: Top Layer, Bottom Layer. Coordinates in mm from the lower left corner of the outline.
Outline path: 0,57.7 0,1.8 arc(0.53,0.53) 1.8,0 95.2,0 arc(96.47,0.53) 97,1.8 97,57.7 arc(96.47,58.97) 95.2,59.5 1.8,59.5 arc(0.53,58.97) 0,57.7
Stack: Top Layer 0.035mm / Dielectric1 1.51mm FR4 er 4.5 / Bottom Layer 0.035mm

## Design rules (mm)
template: 自定义配置
spacing copperThickness1oz (default): track to track 0.102, other pairs 0.152 to 0.3
spacing copperThickness2oz: track to track 0.203, other pairs 0.152 to 0.3
spacing RF: track to track 0.14, other pairs 0.14 to 0.3
track width copperThickness1oz (default): min 0.127, default 0.254, max 2.54
track width copperThickness2oz: min 0.203, default 0.254, max 2.54
track width RF: min 0.152, default 0.584, max 0.584
differential pair differentialPair (default): width min 0.127, default 0.254, max 2.54; gap min 0.152, default 0.152
via viaSize (default): diameter min 0.5, default 0.61, max 10; hole min 0.3, default 0.305, max 6.299
net $5N941 uses RF
['net', '3v3'] ['NET', '+5V'] uses default
['net', 'gnd'] ['NET', '$5N941'] uses RF
region e2274 uses RF

## Placement (name value [footprint] x y rotation side)
3V3  3V3调试口  [HDR-TH_3P-P2.54-V-M]  30.35 12.57 90 top
5V  5V调试口  [HDR-TH_3P-P2.54-V-M]  33.66 12.7 90 top
12V  12V调试口  [HDR-TH_2P-P2.54-V-M-1]  87.25 5.59 45 top
AT1  -  [ESP32天线]  56.54 53.18 0 top
BUZ1  chenzj1:Buzzer_12x9.5RM6.5  [BUZ-TH_BD12.0-P6.50-D0.6_SEA-1285F]  18.8 50.04 180 top
C1  22uF  [C0805]  78.87 11.43 0 top
C2  22uF  [C0805]  87.12 34.8 0 bottom
C3  10uF  [C0805]  83.69 42.55 90 bottom
C4  10uF  [C0805]  74.8 54.23 270 bottom
C5  100nF  [C0603]  72.64 53.85 270 bottom
C6  100nF  [C0603]  65.41 35.69 315 top
C7  100nF  [C0603]  74.8 23.24 135 top
C8  100nF  [C0603]  76.2 33.91 225 top
C9  100nF  [C0603]  60.32 26.67 0 top
C10  10uF  [C0805]  88.52 48.64 180 bottom
C11  20pF  [C0603]  80.39 26.16 0 top
C12  100nF  [C0603]  78.36 35.31 45 bottom
C13  20pF  [C0603]  80.39 32.64 0 top
C14  100nF  [C0603]  75.82 15.49 180 top
C15  100nF  [C0603]  46.48 23.11 270 top
C16  10uF  [C0603]  48.26 23.11 270 top
C17  100nF  [C0603]  41.25 18.42 315 top
C18  100nF  [C0603]  53.97 17.4 270 top
C19  22uF  [C0805]  56.01 17.27 270 top
C20  10nF  [C0603]  53.85 28.83 0 top
C21  100nF  [C0603]  53.85 30.73 0 top
C22  2.2nF  [C0603]  44.07 30.99 180 top
C23  100nF  [C0603]  49.78 34.29 270 top
C24  100nF  [C0603]  61.85 50.17 0 top
C25  2.2nF  [C0603]  51.69 34.29 90 top
CN2  STlink  [CONN-TH_3111-08RG0BK00T1]  67.06 8 180 top
D1  12V稳压&防反接  [LL-34_L3.5-W1.5-RD]  75.56 9.02 180 top
D2  1N4148W  [SOD-123F_L2.7-W1.6-LS3.8-RD]  18.67 57.28 180 top
D3  3V3稳压二极管  [LL-34_L3.5-W1.5-RD]  70.87 17.78 180 top
DC  DC供电口  [DC-2.0]  88.14 14.35 0 top
ECB01C  ECB01C  [SOP-8_L4.9-W3.9-P1.27-LS6.0-BL]  53.85 49.4 270 top
F1  12V 2A 自恢复  [F1206]  81.53 9.14 180 top
GND  GND调试口  [HDR-TH_3P-P2.54-V-M]  37.08 12.7 90 top
HC05  -  [HDR-TH_6P]  35.55 46.36 0 top
LED1  -  [LED_0603]  63.25 20.19 0 top
LED2  -  [LED_0603]  47.85 46.48 180 top
Motor1  电机接口A  [CONN-TH_6P-P2.50_ZX-HA2.54-6PWZ-Y]  26.03 5.46 0 top
Motor2  电机接口B  [CONN-TH_6P-P2.50_ZX-HA2.54-6PWZ-Y]  48.13 5.46 0 top
MPU6050  -  [HDR-TH_8P-P2.54-V-F-1]  37.21 27.43 270 top
OLED1  -  [0.96OLED_4P]  17.91 40.89 0 top
PWR1  NCD0603R1  [LED0603-RD_RED]  80.65 46.61 0 top
Q1  AO3400A  [SOT-23-3_L2.9-W1.3-P1.90-LS2.4-BR]  10.92 49.02 90 top
R1  1kΩ  [R0603]  80.65 48.51 180 top
R2  10K  [R0603]  76.84 36.7 45 bottom
R7  30K  [R0603]  75.82 17.65 0 top
R8  10K  [R0603]  75.82 19.56 180 top
R9  1K  [R0603]  63.12 18.29 0 top
R10  22Ω  [R0603]  28.19 7.75 0 top
R11  22Ω  [R0603]  23.75 7.75 180 top
R12  22Ω  [R0603]  50.29 7.75 0 top
R13  22Ω  [R0603]  45.72 7.75 180 top
R14  10K  [R0603]  43.31 27.18 180 top
R15  10K  [R0603]  43.31 28.96 180 top
R16  1K  [R0603]  47.88 48.26 0 top
R17  1K  [R0603]  11.05 54.36 180 top
R18  10K  [R0603]  11.05 52.07 0 top
RESET  TS-1101-C-W  [SW-SMD_L6.0-W3.3-LS8.0]  73.91 45.72 90 top
SCREW1  -  [M3螺丝]  4.75 3.5 0 top
SCREW2  -  [M3螺丝]  92.25 3.5 0 top
SCREW3  -  [M3螺丝]  4.75 56 0 top
SCREW4  -  [M3螺丝]  92.25 56 0 top
stm32  STM32F103C8T6  [LQFP-48_L7.0-W7.0-P0.50-LS9.0-BL]  68.96 29.34 90 top
SW1  SS-12D10L5  [SW-TH_SS-12D10L5]  92.96 30.1 270 top
TB6612  TB6612模块  [TB6612FNG]  17.4 21.34 0 top
U2  AMS1117-5.0  [SOT-223_L6.5-W3.5-P2.30-LS7.0-BR]  90.17 43.69 0 bottom
U3  AMS1117-3.3  [SOT-223-3_L6.5-W3.4-P2.30-LS7.0-BR]  80.9 53.09 0 bottom
U7  TB6612FNG,C,8,EL  [SSOP-24_L8.3-W5.6-P0.65-LS7.6-BL]  46.74 14.61 0 top
U8  MPU-6050  [QFN-24_L4.0-W4.0-P0.50-BL-EP2.7]  48.5 29.75 0 top
WS2812  WS2812  [LED-SMD_4P-L5.0-W5.0-TL-A]  29.72 48.64 0 top
X1  8MHz  [CRYSTAL-SMD_4P-L3.2-W2.5-BL]  80.39 29.34 270 top
X2  16MHz  [OSC-SMD_4P-L3.2-W2.5-BL]  62.61 47.12 0 top
XH254  XH2.54供电口  [CONN-TH_2P-P2.50-XH2.54-2P]  79.25 3.81 0 top

## Footprints (pads in the part's own frame, mm; a bottom-side part is the same pattern mirrored in y, then rotated)
0.96OLED_4P
  round 1.65 hole 1: 1(-3.81,-0.002) 2(-1.27,0.002) 3(1.27,0.002) 4(3.81,0.002)
BUZ-TH_BD12.0-P6.50-D0.6_SEA-1285F
  round 1.524 hole 0.914: 1(-3.25,0) 2(3.25,0)
C0603
  rect 0.8x0.9 smd: 1(-0.7,0) 2(0.7,0)
C0805
  rect 1.41x1.35 smd: 1(-1,0) 2(1,0)
CONN-TH_2P-P2.50-XH2.54-2P
  round 1.7 hole 1.05: 1(1.25,0) 2(-1.25,0)
CONN-TH_6P-P2.50_ZX-HA2.54-6PWZ-Y
  rect 1.5x1.5 hole 0.9: 1(-6.25,0)
  round 1.5 hole 0.9: 2(-3.75,0) 3(-1.25,0) 4(1.25,0) 5(3.75,0) 6(6.25,0)
CONN-TH_3111-08RG0BK00T1
  rect 1.7x1.7 hole 1.1: 1(-3,-1)
  round 1.7 hole 1.1: 2(-3,1) 3(-1,-1) 4(-1,1) 5(1,-1) 6(1,1) 7(3,-1) 8(3,1)
CRYSTAL-SMD_4P-L3.2-W2.5-BL
  rect 1.4x1.2 smd: 1(-1.1,-0.85) 2(1.1,-0.85) 3(1.1,0.85) 4(-1.1,0.85)
DC-2.0
  oval 4x1.3 hole 3.5x0.8: 2(-0.627,5.067)
  oval 1.3x4 hole 0.8x3.5: 3(2.873,0.267) 4(-3.127,0.267)
ESP32天线
  rect 0.924x0.5 smd: 1(2.1,0.004)
  rect 0.526x0.5 smd: 2(0,0.001)
F1206
  rect 1.19x1.728 smd: 1(-1.445,0) 2(1.445,0)
HDR-TH_2P-P2.54-V-M-1
  rect 1.8x1.8 hole 1.1: 1(-1.27,0)
  round 1.8 hole 1.1: 2(1.27,0)
HDR-TH_3P-P2.54-V-M
  rect 1.7x1.7 hole 1.1: 1(-2.54,0)
  round 1.7 hole 1.1: 2(0,0) 3(2.54,0)
HDR-TH_6P
  rect 1.524x1.524 hole 0.914: 1(0,6.35)
  round 1.524 hole 0.914: 2(0,3.81) 3(0,1.27) 4(0,-1.27) 5(0,-3.81) 6(0,-6.35)
HDR-TH_8P-P2.54-V-F-1
  rect 1.8x1.8 hole 1.2: 1(-8.89,0)
  round 1.8 hole 1.2: 2(-6.35,0) 3(-3.81,0) 4(-1.27,0) 5(1.27,0) 6(3.81,0) 7(6.35,0) 8(8.89,0)
LED0603-RD_RED
  rect 0.8x0.8 smd: 1(-0.799,-0.004) 2(0.799,0.004)
LED-SMD_4P-L5.0-W5.0-TL-A
  rect 1.6x1.2 smd: 1(-2.35,1.6) 2(-2.35,-1.6) 3(2.35,-1.6) 4(2.35,1.6)
LED_0603
  rect 0.8x0.8 smd: 1(-0.851,-0.01) 2(0.75,-0.005)
LL-34_L3.5-W1.5-RD
  rect 1.1x1.7 smd: 1(-1.7,0) 2(1.7,0)
LQFP-48_L7.0-W7.0-P0.50-LS9.0-BL
  oval 0.27x1.5 smd: 1(-2.75,-4.25) 2(-2.25,-4.25) 3(-1.75,-4.25) 4(-1.25,-4.25) 5(-0.75,-4.25) 6(-0.25,-4.25) 7(0.25,-4.25) 8(0.75,-4.25) 9(1.25,-4.25) 10(1.75,-4.25) 11(2.25,-4.25) 12(2.75,-4.25) 25(2.75,4.25) 26(2.25,4.25) 27(1.75,4.25) 28(1.25,4.25) 29(0.75,4.25) 30(0.25,4.25) 31(-0.25,4.25) 32(-0.75,4.25) 33(-1.25,4.25) 34(-1.75,4.25) 35(-2.25,4.25) 36(-2.75,4.25)
  oval 1.5x0.27 smd: 13(4.25,-2.75) 14(4.25,-2.25) 15(4.25,-1.75) 16(4.25,-1.25) 17(4.25,-0.75) 18(4.25,-0.25) 19(4.25,0.25) 20(4.25,0.75) 21(4.25,1.25) 22(4.25,1.75) 23(4.25,2.25) 24(4.25,2.75) 37(-4.25,2.75) 38(-4.25,2.25) 39(-4.25,1.75) 40(-4.25,1.25) 41(-4.25,0.75) 42(-4.25,0.25) 43(-4.25,-0.25) 44(-4.25,-0.75) 45(-4.25,-1.25) 46(-4.25,-1.75) 47(-4.25,-2.25) 48(-4.25,-2.75)
M3螺丝
  round 3.2 hole 3.2: 1(0,0)
OSC-SMD_4P-L3.2-W2.5-BL
  rect 1.4x1.2 smd: 1(-1.1,-0.875) 2(1.1,-0.875) 3(1.1,0.875) 4(-1.1,0.875)
QFN-24_L4.0-W4.0-P0.50-BL-EP2.7
  oval 0.28x0.8 smd: 1(-1.25,-2) 2(-0.75,-2) 3(-0.25,-2) 4(0.25,-2) 5(0.75,-2) 6(1.25,-2) 13(1.25,2) 14(0.75,2) 15(0.25,2) 16(-0.25,2) 17(-0.75,2) 18(-1.242,2)
  oval 0.8x0.28 smd: 7(2,-1.25) 8(2,-0.75) 9(2,-0.25) 10(2,0.25) 11(2,0.75) 12(2,1.25) 19(-2,1.25) 20(-2,0.75) 21(-2,0.25) 22(-2,-0.25) 23(-2,-0.75) 24(-2,-1.25)
  rect 2.7x2.7 smd: 25(0.013,0)
R0603
  rect 0.806x0.864 smd: 1(-0.753,0) 2(0.753,0)
SOD-123F_L2.7-W1.6-LS3.8-RD
  rect 1.1x1 smd: 1(-1.735,0) 2(1.735,0)
SOP-8_L4.9-W3.9-P1.27-LS6.0-BL
  oval 0.63x1.865 smd: 1(-1.905,-2.683) 2(-0.635,-2.683) 3(0.635,-2.683) 4(1.905,-2.683) 5(1.905,2.683) 6(0.635,2.683) 7(-0.635,2.683) 8(-1.905,2.683)
SOT-23-3_L2.9-W1.3-P1.90-LS2.4-BR
  rect 1.25x0.7 smd: 1(1,-0.95) 2(1,0.95) 3(-1,0)
SOT-223-3_L6.5-W3.4-P2.30-LS7.0-BR
  rect 2.5x1.1 smd: 1(2.97,-2.3) 2(2.97,0) 3(2.97,2.3)
  rect 2.34x3.6 smd: 4(-2.97,0)
SOT-223_L6.5-W3.5-P2.30-LS7.0-BR
  rect 2.465x1.05 smd: 1(2.857,-2.3) 2(2.857,0) 3(2.857,2.3)
  rect 2.465x3.54 smd: 4(-2.857,0)
SSOP-24_L8.3-W5.6-P0.65-LS7.6-BL
  oval 0.308x1.324 smd: 1(-3.575,-3.562) 2(-2.925,-3.562) 3(-2.275,-3.562) 4(-1.625,-3.562) 5(-0.975,-3.562) 6(-0.325,-3.562) 7(0.325,-3.562) 8(0.975,-3.562) 9(1.625,-3.562) 10(2.275,-3.562) 11(2.925,-3.562) 12(3.575,-3.562) 13(3.575,3.562) 14(2.925,3.562) 15(2.275,3.562) 16(1.625,3.562) 17(0.975,3.562) 18(0.325,3.562) 19(-0.325,3.562) 20(-0.975,3.562) 21(-1.625,3.562) 22(-2.275,3.562) 23(-2.925,3.562) 24(-3.575,3.562)
SW-SMD_L6.0-W3.3-LS8.0
  rect 1.9x1.5 smd: 1(-4,0) 2(4,0)
SW-TH_SS-12D10L5
  oval 2x3 hole 1.3x2: 1(-4.7,0) 2(0,0) 3(4.7,0)
TB6612FNG
  round 1.5 hole 0.762: 1(-7.6,8.89) 2(-7.6,6.35) 3(-7.6,3.81) 4(-7.6,1.27) 5(-7.6,-1.27) 6(-7.6,-3.81) 7(-7.6,-6.35) 8(-7.6,-8.89) 9(7.6,8.89) 10(7.6,6.35) 11(7.6,3.81) 12(7.6,1.27) 13(7.6,-1.27) 14(7.6,-3.81) 15(7.6,-6.35) 16(7.6,-8.89)

## Nets
3V3: 3V3.1 3V3.2 3V3.3 C4.2 C5.2 C6.2 C7.2 C8.2 C9.2 C15.2 C16.2 C20.1 C23.2 C24.1 C25.1 CN2.1 ECB01C.7 MPU6050.1 R1.2 R2.2 R9.1 R14.2 R15.2 stm32.1 stm32.9 stm32.24 stm32.36 stm32.48 TB6612.2 TB6612.12 U3.2 U3.4 U7.19 U7.20 U8.8 U8.13
+5V: 5V.1 5V.2 5V.3 BUZ1.1 C3.2 C10.2 CN2.8 D2.1 HC05.5 Motor1.5 Motor2.5 OLED1.2 U2.2 U2.4 U3.3 WS2812.1
+12V: 12V.1 12V.2 DC.4 F1.1 XH254.1
GND: AT1.1 C1.1 C2.1 C3.1 C4.1 C5.1 C6.1 C7.1 C8.1 C9.1 C10.1 C11.1 C12.2 C13.2 C14.1 C15.1 C16.1 C17.1 C18.2 C19.2 C20.2 C21.2 C22.2 C23.1 C24.2 C25.2 CN2.7 D1.2 D3.2 DC.2 DC.3 ECB01C.1 GND.1 GND.2 GND.3 HC05.4 LED2.1 Motor1.2 Motor2.2 MPU6050.2 MPU6050.7 OLED1.1 PWR1.1 Q1.2 R8.1 R18.1 RESET.2 stm32.8 stm32.23 stm32.35 stm32.44 stm32.47 TB6612.3 TB6612.8 TB6612.16 U2.1 U3.1 U7.3 U7.4 U7.9 U7.10 U7.18 U8.1 U8.9 U8.11 U8.18 U8.25 WS2812.3 X1.2 X1.4 X2.2 X2.4 XH254.2
VIN_12V: C2.2 C17.2 C18.1 C19.1 R7.2 SW1.1 TB6612.1 U2.3 U7.13 U7.14 U7.24
AIN1: stm32.27 TB6612.11 U7.21
AIN2: stm32.28 TB6612.10 U7.22
AO1: Motor1.6 TB6612.4 U7.1 U7.2
AO2: Motor1.1 TB6612.5 U7.5 U7.6
B1A: R10.2 stm32.38
B1B: R11.2 stm32.39
B2A: R12.2 stm32.40
B2B: R13.2 stm32.41
BAT_DET: C14.2 D3.1 R7.1 R8.2 stm32.11
BIN1: stm32.26 TB6612.13 U7.17
BIN2: stm32.25 TB6612.14 U7.16
BO1: Motor2.1 TB6612.7 U7.11 U7.12
BO2: Motor2.6 TB6612.6 U7.7 U7.8
BUZZER-EN: R17.1 stm32.33
I2C2-SCL: MPU6050.3 R15.1 stm32.21 U8.23
I2C2-SDA: MPU6050.4 R14.1 stm32.22 U8.24
LED: LED1.1 stm32.43
MPU-INT: MPU6050.8 stm32.20 U8.12
NRST: C12.1 CN2.2 R2.1 RESET.1 stm32.7
OLED-SCL: OLED1.3 stm32.15
OLED-SDA: OLED1.4 stm32.17
OSC_IN: C11.2 stm32.5 X1.3
OSC_OUT: C13.1 stm32.6 X1.1
PA2: ECB01C.3 HC05.2 stm32.12
PA3: ECB01C.2 HC05.3 stm32.13
PA6: stm32.16
PA9: CN2.6 stm32.30
PA10: CN2.4 stm32.31
PA13: CN2.3 stm32.34
PA14: CN2.5 stm32.37
PB6: stm32.42 WS2812.4
PB8: stm32.45 TB6612.15 U7.15
PB9: stm32.46 TB6612.9 U7.23
$1N4253: C1.2 D1.1 F1.2 SW1.2
$1N5616: Q1.1 R17.2 R18.2
$1N5651: BUZ1.2 D2.2 Q1.3
$2N1115: PWR1.2 R1.1
$2N2795: LED1.2 R9.2
$3N1988: Motor1.4 R10.1
$3N1994: Motor1.3 R11.1
$3N2076: Motor2.4 R12.1
$3N2080: Motor2.3 R13.1
$4N663: C21.1 U8.10
$4N779: C22.1 U8.20
$5N309: ECB01C.4 R16.2
$5N416: LED2.2 R16.1
$5N543: ECB01C.5 X2.1
$5N549: ECB01C.6 X2.3
$5N941: AT1.2 ECB01C.8

Pads without a net: HC05 1 6; MPU6050 5 6; SCREW1 1; SCREW2 1; SCREW3 1; SCREW4 1; stm32 2 3 4 10 14 18 19 29 32; SW1 3; U8 2 3 4 5 6 7 14 15 16 17 19 21 22; WS2812 2

## Via types
v1: diameter 0.762, hole 0.508, Top Layer to Bottom Layer, 1 via
v2: diameter 0.61, hole 0.305, Top Layer to Bottom Layer, 210 vias
v3: diameter 1.143, hole 0.762, Top Layer to Bottom Layer, 2 vias

## Routing (per net, layer and track width the routed paths; a pad name or vN(x,y) marks a point on that pad's centre or on a via; arc(x,y) is an arc through that point)
3V3: length 318.4
  Top Layer w0.254: 75.71,33.41 75.18,32.89 75.18,31.24 74.55,30.61 73.23,30.61 stm32.9 ; stm32.36 64.63,26.67 C9.2 ; C25.1 C23.2 49.78,31.78 U8.13 ; U7.20 45.54,18.38 45.54,18.85 45.54,18.86 45.54,22.05 45.91,22.41 C15.2 ; U8.8 50.54,28.96 51.69,28.96 51.82,28.83 C20.1 ; ECB01C.7 56.66,50.17 C24.1 61.15,50.61 61.72,51.18 63.88,51.18 v2(65.28,49.78) ; stm32.48 71.71,24.3 72.39,23.62 74.19,23.62 C7.2 74.31,26.29 74.05,26.54 73.25,26.54 stm32.1 ; C16.2 C15.2 ; C15.2 46.48,18.24 U7.19 ; stm32.24 66.21,34.88 C6.2
  Top Layer w0.381: v2(51.33,23.37) 50.91,22.96 48.81,22.96 C16.2 ; C20.1 53.15,28.26 52.83,27.94 v2(52.83,27.43) ; C7.2 75.04,23.74 v2(76.33,25.02) ; R9.1 61.47,18.29 61.03,18.73 C9.2 61.09,26.73 v2(61.09,28.58) ; R15.2 42.54,28.95 v2(42.54,25.78) ; v2(64.39,33.66) 65.9,35.17 C6.2 ; v2(53.97,33.53) 51.75,33.53 C25.1 ; R1.2 79.76,48.64 v2(77.6,48.64) ; 75.71,33.41 75.68,33.41 v2(74.55,34.54)
  Bottom Layer w0.381: 66.42,28.07 65.75,28.74 65.75,30.61 ; v2(65.28,49.78) 72.62,49.78 72.64,49.8 ; 76.17,43.51 73.99,43.51 72.52,42.04 72.52,36.58 73.47,35.62 ; 76.17,43.51 76.17,38.44 R2.2 ; 76.17,43.51 76.17,47.91 ; 73.47,35.62 v2(74.55,34.54) ; 73.47,35.62 70.37,32.51 70.08,32.51 ; CN2.1 70.06,17.19 68.47,18.77 68.47,26.55 66.96,28.07 66.42,28.07 ; 52.83,24.67 52.83,24.13 52.08,23.37 v2(51.33,23.37) ; 52.83,24.67 v2(52.83,27.43) 55.63,27.43 56.77,28.58 v2(61.09,28.58) 61.94,29.43 64.05,29.43 65.24,30.61 65.75,30.61 ; 52.83,24.67 42.89,24.67 42.54,25.02 v2(42.54,25.78) ; TB6612.12 21.08,22.61 ; 21.08,22.61 21.08,17.91 22.73,16.26 29.21,16.26 3V3.3 3V3.2 3V3.1 ; 21.08,22.61 21.08,33.66 23.75,36.32 MPU6050.1 41.02,32.51 53.97,32.51 ; 21.08,22.61 14.88,22.61 TB6612.2 ; 65.75,30.61 68.33,30.61 69.03,31.31 69.03,32.51 ; 76.17,47.91 73.37,47.91 72.64,48.64 72.64,49.8 ; 76.17,47.91 76.87,47.91 v2(77.6,48.64) ; 72.85,53.15 74.72,53.15 C4.2 74.95,53.09 U3.4 U3.2 ; 72.64,49.8 C5.2 ; 53.97,32.51 v2(53.97,33.53) ; 53.97,32.51 64.4,32.51 ; v2(64.39,33.66) 64.39,32.52 64.4,32.51 ; 70.08,32.51 70.08,22.63 72.64,20.07 74.78,20.07 74.8,20.05 75.33,20.05 75.35,20.07 77.34,20.07 78.1,20.83 78.1,23.24 v2(76.33,25.02) ; 70.08,32.51 69.03,32.51 ; 69.03,32.51 64.4,32.51
+5V: length 252.9
  Top Layer w0.508: D2.1 22.1,55.58 22.1,50.29 ; 5V.2 33.68,12.67 v1(33.68,6.6) ; WS2812.1 27.17,50.04 BUZ1.1
  Bottom Layer w0.508: U2.2 U2.4 87.17,43.55 C3.2 ; HC05.5 34.28,43.81 22.05,43.81 ; 29.59,1.65 13.97,1.65 4.7,10.92 4.7,38.73 9.78,43.81 16.72,43.81 ; 29.59,1.65 29.59,5.27 Motor1.5 ; 29.59,1.65 33.68,1.65 ; 51.88,1.65 33.68,1.65 ; 51.88,1.65 Motor2.5 ; 51.88,1.65 63.95,1.65 ; 33.68,1.65 33.68,1.65 v1(33.68,6.6) ; C3.2 83.69,45.72 84.46,46.48 86.74,46.48 87.52,47.26 C10.2 87.52,50.02 86.75,50.79 U3.3 ; C3.2 81.79,41.64 81.79,36.96 84.33,34.42 84.33,23.75 74.04,13.46 74.04,3.81 71.88,1.65 63.95,1.65 ; 16.72,43.81 22.05,43.81 ; 16.72,43.81 16.72,40.98 OLED1.2 ; 22.05,43.81 BUZ1.1 ; CN2.8 64.06,1.76 63.95,1.65 ; 5V.2 5V.3
+12V: length 20.4
  Top Layer w1: 12V.2 85.47,3.81 82.99,3.81 ; DC.4 85.01,11.18 82.98,9.14 82.99,9.13 82.99,3.81 ; 82.99,3.81 XH254.1
GND: length 136.7
  Top Layer w0.254: R8.1 78.38,19.56 v2(79.2,20.37) ; 48.67,11.04 48.67,10.31 49.28,9.7 51.71,9.7 52.17,9.25 52.17,7.01 52.73,6.45 v2(53.14,6.45) ; 48.67,11.04 U7.10 ; 48.67,11.04 U7.9 ; v2(66.19,26.62) 65.72,27.09 stm32.35 ; U8.18 47.26,31 U8.25 ; U8.11 49.26,30.5 U8.25 ; U8.25 48.76,29.5 U8.9 ; U8.25 47.25,28.49 U8.1 ; v2(55.68,31.19) 55.22,30.73 C21.2 ; v2(50.7,3.56) 53.08,3.56 v2(53.11,3.58) ; v2(75.77,31.04) 76.58,31.04 v2(76.67,31.13) v2(77.56,31.13) v2(78.36,31.13) v2(78.36,32.07) v2(78.36,32.94) 78.74,33.32 v2(78.74,33.66) v2(79.63,33.66) v2(80.51,33.66) v2(81.37,33.66) 81.79,33.66 v2(82.3,33.15) v2(82.3,32.26) 82.8,31.75 v2(82.8,31.5) v2(82.8,30.61) v2(82.8,29.76) v2(82.8,28.92) v2(82.8,27.96) v2(82.8,27.06) 82.8,26.92 v2(82.3,26.42) v2(82.3,25.62) 82.3,25.4 v2(81.79,24.89) v2(80.86,24.89) v2(79.88,24.89) v2(78.92,24.89) 78.36,25.46 v2(78.36,25.6) v2(78.36,26.44) v2(78.36,27.32) v2(78.36,28.06) 78.36,28.25 v2(77.85,28.75) v2(77.01,28.75) 76.18,28.75 ; v2(63.45,35.46) 64.19,35.46 C6.1 ; stm32.23 66.71,32.78 66.45,32.51 64.11,32.51 v2(62.79,33.83) ; 63.71,46.24 63.26,46.24 X2.4 ; C9.1 v2(59.62,24.94) ; v2(43.8,9.2) 44.46,9.86 U7.3 U7.4
  Top Layer w0.508: 63.71,46.24 63.75,46.2 v2(63.75,44.5)
  Top Layer w0.762: 81.09,32.64 81.09,33.59 81.03,33.66 ; v2(82.8,30.61) 82.63,30.44 X1.4 ; 79.54,28.24 79.69,28.09 C11.1 79.69,25.03 79.55,24.89
  Bottom Layer w0.254: 41.66,25.47 41.66,24.84 42.52,23.98 42.57,23.98 42.73,23.82 v2(44.69,23.82) ; 41.66,25.47 41.53,25.35 40.13,25.35 39.95,25.17 39.95,22.25 40.87,21.34 v2(48.01,21.34) ; 41.66,25.47 41.66,26.11 42.47,26.92 44.96,26.92 v2(45.77,26.11) ; v2(47.55,19.86) 47.96,20.28 52.57,20.28 52.93,19.91 v2(52.93,15.85) ; v2(39.17,16.14) 38.27,15.24 GND.3 ; v2(59.62,24.94) 62.03,24.94 v2(62.13,25.04) ; v2(50.7,3.56) 49.99,2.84 39.17,2.84 37.95,4.06 v2(37.95,6.35) 37.95,7.19 38.56,7.8 42.4,7.8 v2(43.8,9.2)
  vias: v2(5.44,51.16) v2(5.44,46.08) v2(5.44,41) v2(5.44,35.92) v2(5.44,30.84) v2(5.44,25.76) v2(5.44,20.68) v2(5.44,15.6) v2(10.52,51.16) v2(10.52,46.08) v2(10.52,41) v2(10.52,35.92) v2(10.52,10.52) v2(15.6,46.08) v2(15.6,35.92) v2(15.6,30.84) v2(15.6,25.76) v2(15.6,20.68) v2(15.6,15.6) v2(15.6,10.52) v2(20.68,51.16) v2(20.68,46.08) v2(20.68,35.92) v2(20.68,15.6) v2(24.41,31.52) v2(25.76,56.24) v2(25.76,51.16) v2(25.76,46.08) v2(25.76,10.52) v2(26.44,12.57) v2(26.71,32.81) v2(26.71,27.73) v2(28.43,9.5) v2(29.49,31.52) v2(29.49,26.44) v2(30.84,56.24) v2(30.84,51.16) v2(30.84,46.08) v2(30.84,30.84) v2(30.84,25.76) v2(30.84,20.68) v2(31.79,32.81) v2(34.57,31.52) v2(34.57,26.44) v2(34.57,21.36) v2(35.77,10.52) v2(35.92,56.24) v2(35.92,20.68) v2(39.57,15.49) v2(39.65,11.2) v2(39.88,17.98) v2(40.55,20.43) v2(41,51.16) v2(41,46.08) v2(41,41) v2(41,35.92) v2(41,25.76) v2(41,10.52) v2(41.73,20.43) v2(41.86,8.48) v2(42.11,19.36) v2(43.34,28.01) v2(45.38,23.11) v2(46.08,51.16) v2(46.08,46.08) v2(46.08,41) v2(46.08,35.92) v2(46.63,26.09) v2(47.55,26.06) v2(49.25,25.94) v2(49.86,23.7) v2(50.53,25.94) v2(51.16,46.08) v2(51.16,35.92) v2(51.68,25.94) v2(52.55,36.79) v2(54.89,21.36) v2(54.89,16.28) v2(56.14,40.39) v2(56.24,46.08) v2(56.24,35.92) v2(56.24,5.44) v2(59.74,43.98) v2(59.97,6.12) v2(60.08,24.45) v2(61.32,5.44) v2(66.4,51.16) v2(66.4,46.08) v2(66.4,41) v2(66.4,15.6) v2(66.4,10.52) v2(71.48,56.24) v2(71.48,51.16) v2(71.48,46.08) v2(71.48,41) v2(76.17,28.75) v2(76.56,56.24) v2(76.56,10.52) v2(76.56,5.44) v2(78.23,15.39) v2(81.64,56.24) v2(81.64,51.16) v2(81.64,35.92) v2(81.64,10.52) v2(86.72,56.24) v2(86.72,41) v2(86.72,35.92) v2(86.72,30.84) v2(86.72,20.68) v2(86.72,15.6) v2(86.72,10.52) v2(91.8,51.16) v2(91.8,20.68) v2(91.8,10.52)
VIN_12V: length 184.5
  Top Layer w1: v3(56.9,20.83) 56.01,19.94 C19.1 55.9,18.16 51.22,18.16 ; 51.22,18.16 51.22,14.73 50.51,14.03 41.73,14.03 40.64,15.11 40.64,16.76 41.78,17.91 ; 51.22,18.16 49.91,18.16 ; 42.93,18.03 42.81,17.92 C17.2 ; 81.28,17.65 R7.2 ; 81.28,17.65 81.28,15.62 78.99,13.33 64.26,13.33 62.74,11.81 v3(58.93,11.81) ; 81.28,17.65 81.28,21.59 92.96,33.27 SW1.1
  Bottom Layer w1: TB6612.1 8.25,30.23 6.73,28.7 6.73,11.05 9.78,8 14.73,8 17.4,10.67 23.37,10.67 25.51,8.53 40.36,8.53 43.21,11.37 55.07,11.37 56.9,13.2 58.93,13.2 ; v3(56.9,20.83) 57.97,19.75 57.97,15.48 58.93,14.52 58.93,13.2 ; 58.93,13.2 v3(58.93,11.81) ; SW1.1 88.12,34.8 88.14,34.81 88.14,36.7 89.03,37.59 91.57,37.59 93.03,39.05 U2.3
AIN1: length 56.7
  Top Layer w0.254: stm32.27 64.68,31.11 58.66,31.11 57.07,29.53 57.07,25.59 54.78,23.29 53.26,23.29 50.9,20.92 v2(50.9,19.69) ; v2(45.91,15.57) 45.52,15.57 45.11,15.98 U7.21 45.09,18.19 45.09,20.57 43.31,22.35 32.51,22.35 29.72,25.15 TB6612.11
  Bottom Layer w0.254: v2(45.91,15.57) 46.4,16.05 48.7,16.05 50.9,18.25 v2(50.9,19.69)
AIN2: length 65.2
  Top Layer w0.254: v2(44.32,14.98) 44.32,18.03 U7.22 44.46,19.04 43.6,19.9 43.6,20.92 42.54,21.97 39.5,21.97 38.86,21.34 38.86,20.7 38.06,19.9 34.46,19.9 30.61,23.75 23.62,23.75 23.11,24.26 23.11,25.8 TB6612.10 ; v2(51.74,19.69) 51.74,21.26 53.41,22.94 54.93,22.94 57.43,25.44 57.43,29.38 58.64,30.59 stm32.28
  Bottom Layer w0.254: v2(44.32,14.98) 47.56,14.98 48.28,15.7 48.84,15.7 51.74,18.59 v2(51.74,19.69)
AO1: length 54.6
  Top Layer w0.254: TB6612.4 12.19,22.61 13.84,20.95 13.84,8.76 15.75,6.86 20.45,6.86 21.08,6.22 21.08,4.83 21.97,3.94 31.24,3.94 32.29,4.98 Motor1.6 39.37,5.46 40.9,6.98 41.91,6.98 43.05,8.13 43.05,10.94 U7.1 43.81,11.04
AO2: length 55.1
  Top Layer w0.254: U7.6 U7.5 45.76,9.57 45.21,9.02 44.45,9.02 42.06,6.63 41.05,6.63 39.88,5.46 39.88,3.94 39.24,3.3 21.94,3.3 Motor1.1 15.11,5.46 12.95,7.62 12.95,18.8 11.68,20.07 TB6612.5
B1A: length 66.7
  Top Layer w0.254: stm32.38 66.63,25 66.63,24.3 66.2,23.88 v2(61.93,23.88) ; v2(60.58,16.38) 58.93,14.73 53.59,14.73 53.57,14.71 52.43,14.71 50.06,12.34 41.58,12.34 37.54,16.38 23.75,16.38 22.86,15.49 22.86,11.68 24.64,9.91 26.79,9.91 R10.2
  Bottom Layer w0.254: v2(60.58,16.38) 60.58,22.53 v2(61.93,23.88)
B1B: length 62.8
  Top Layer w0.254: v2(22.99,9.65) 22.99,7.76 R11.2 ; v2(62.1,22.86) 62.64,23.39 66.22,23.39 67.21,24.38 stm32.39 ; v2(40.18,7.21) 34.95,7.21 v2(34.9,7.26)
  Bottom Layer w0.254: v2(22.99,9.65) 25.37,7.26 v2(34.9,7.26) ; v2(62.1,22.86) 63.07,21.89 63.07,11.75 61.96,10.64 51.98,10.64 48.55,7.21 v2(40.18,7.21)
B2A: length 32.2
  Top Layer w0.254: R12.2 51.18,7.88 v2(51.18,9.02) ; stm32.40 67.71,23.52 66.93,22.73 v2(63.37,22.73)
  Bottom Layer w0.254: v2(51.18,9.02) 52.2,9.02 53.47,10.29 62.11,10.29 63.5,11.68 63.5,21.83 63.42,21.91 63.42,22.39 63.5,22.47 63.5,22.61 v2(63.37,22.73)
B2B: length 43.9
  Top Layer w0.254: v2(64.01,22.15) 66.98,22.15 68.2,23.37 68.2,25.08 stm32.41 ; v2(45.72,3.81) 45.72,6.1 44.97,6.85 R13.2
  Bottom Layer w0.254: v2(64.01,22.15) 64.01,11.68 62.23,9.91 55.25,9.91 52.07,6.73 46.48,6.73 45.72,5.97 v2(45.72,3.81)
BAT_DET: length 22.9
  Top Layer w0.254: v2(70.99,31.62) 73.18,31.62 stm32.11 ; R8.2 v2(75.07,20.7)
  Top Layer w0.5: C14.2 75.07,15.55 R7.1
  Top Layer w0.508: 75.07,18.47 R7.1 ; 75.07,18.47 R8.2 ; 75.07,18.47 75.01,18.42 73.79,18.42 73.15,17.78 D3.1
  Bottom Layer w0.254: v2(70.99,31.62) 70.99,24.77 v2(75.07,20.7)
BIN1: length 52.9
  Top Layer w0.254: stm32.26 64.68,31.62 58.67,31.62 56.72,29.67 56.72,25.74 54.63,23.65 52.93,23.65 50.06,20.78 v2(50.06,19.69) ; 47.71,18.17 v2(47.71,16.64)
  Bottom Layer w0.254: TB6612.13 28.57,20.07 31.92,16.72 47.62,16.72 v2(47.71,16.64) 48.78,16.64 50.06,17.92 v2(50.06,19.69)
BIN2: length 70.4
  Top Layer w0.254: v2(48.39,14.98) 48.39,18.14 U7.16 48.36,19.58 52.78,24 54.48,24 56.36,25.88 56.36,29.82 58.55,32 64.63,32 stm32.25
  Bottom Layer w0.254: v2(48.39,14.98) 53.47,14.98 54.1,14.35 54.1,12.7 53.54,12.14 38.76,12.14 38.15,11.53 35.71,11.53 35.15,12.09 35.15,15.95 34.74,16.37 30.6,16.37 30.3,16.67 25.85,16.67 TB6612.14
BO1: length 67
  Top Layer w0.254: TB6612.7 11.3,13.48 11.3,11.56 12.6,10.26 12.6,7.47 14.97,5.11 17.75,5.11 19.91,2.95 39.39,2.95 40.23,3.79 40.23,3.81 Motor2.1 44.45,2.9 53.57,2.9 55.5,4.83 55.5,6.35 55.19,6.66 54.18,6.66 52.83,8 52.83,10.29 52.08,11.04 U7.11
BO2: length 91.3
  Top Layer w0.254: TB6612.6 7.87,17.53 7.01,16.66 7.01,4.88 10.24,1.65 55.37,1.65 57.78,4.06 57.78,6.73 v2(56.13,8.38) ; Motor2.6 53.14,4.22 49,4.22 48.26,4.95 48.26,8.13 47.75,8.64 47.75,11 47.71,11.04 U7.7
  Bottom Layer w0.254: v2(56.13,8.38) 54.99,8.38 54.38,7.77 Motor2.6
BUZZER-EN: length 92.1
  Top Layer w0.254: v2(62.74,27.81) 63.01,28.09 stm32.33 ; v2(41.28,23.62) 39.12,23.62 37.85,24.89 34.16,24.89 28.07,30.99 28.07,32.77 26.29,34.54 10.03,34.54 6.6,37.97 6.6,50.8 8.25,52.45 8.25,55.63 9.14,56.52 11.18,56.52 11.68,56.01 11.68,54.47 R17.1
  Bottom Layer w0.254: v2(41.28,23.62) 42.6,22.3 53.93,22.3 59.44,27.81 v2(62.74,27.81)
I2C2-SCL: length 43.9
  Top Layer w0.254: 45.27,28.96 46.46,28.96 U8.23 ; 45.27,28.96 45.34,28.88 v2(45.34,27.81) ; 45.27,28.96 R15.1 42.92,30.1 41.4,30.1 40.26,31.24 MPU6050.3 ; v2(48.64,26.67) 54.99,26.67 55.63,27.31 55.63,30.09 63.25,37.72 66.54,37.72 67.71,36.55 stm32.21
  Bottom Layer w0.254: v2(48.64,26.67) 46.48,26.67 v2(45.34,27.81)
I2C2-SDA: length 47.7
  Top Layer w0.254: MPU6050.4 37.21,28.32 40.39,25.15 44.05,25.15 ; U8.24 46.5,27.32 46.22,27.04 44.2,27.04 R14.1 44.05,27.16 44.05,25.15 44.05,25.15 ; 44.05,25.15 54.36,25.15 56.01,26.8 56.01,29.97 63.37,37.34 66.42,37.34 67.18,36.58 67.18,33.61 stm32.22
LED: length 10.1
  Top Layer w0.254: LED1.1 62.4,20.36 63.12,21.08 67.18,21.08 69.21,23.11 stm32.43
MPU-INT: length 67.3
  Top Layer w0.254: v2(68.07,31.5) 68.21,31.64 stm32.20 68.3,33.67 68.3,36.47 66.65,38.12 63.15,38.12 57.03,32 52.83,32 51.82,30.99 50.51,30.99 U8.12
  Bottom Layer w0.254: MPU6050.8 39.12,20.45 39.12,28.19 40.77,29.84 63.88,29.84 65.53,31.5 v2(68.07,31.5)
NRST: length 99.3
  Top Layer w0.254: stm32.7 v2(71.63,29.59) ; CN2.2 71.14,7 72.01,7.87 72.01,10.67 71.37,11.3 63.75,11.3 62.74,10.29 57.4,10.29 56.51,11.18 56.51,11.94 57.4,12.83 62.23,12.83 68.96,19.56 72.14,19.56 73.86,21.29 76.91,21.29 79.12,23.5 82.15,23.5 84.33,25.67 84.33,36.58 79.12,41.78 73.98,41.78 RESET.1 v2(73.91,39.5)
  Bottom Layer w0.254: v2(73.91,39.5) 73.91,38.56 R2.1 76.5,36.17 C12.1 75.36,32.31 72.32,32.31 71.63,31.62 v2(71.63,29.59)
OLED-SCL: length 56.6
  Top Layer w0.254: OLED1.3 20.57,42.29 25.02,42.29 26.03,41.28 30.6,41.28 33.05,38.83 66.94,38.83 70.71,35.06 stm32.15
OLED-SDA: length 52.2
  Top Layer w0.254: OLED1.4 21.97,40.9 22.1,40.77 30.61,40.77 32.9,38.48 66.79,38.48 69.71,35.56 stm32.17
OSC_IN: length 11
  Top Layer w0.254: stm32.5 73.22,28.58 74.93,28.58 75.81,29.46 80.02,29.46 81.24,28.24 81.24,26.31 81.09,26.16
OSC_OUT: length 9.2
  Top Layer w0.254: C13.1 79.69,30.59 X1.1 79.5,30.48 76.07,30.48 74.68,29.08 73.22,29.08 stm32.6
PA2: length 56.1
  Top Layer w0.254: 45.09,49.53 49.15,49.53 49.91,48.77 ECB01C.3 ; 45.09,49.53 45.09,43.18 48.64,39.62 67.16,39.62 73.21,33.57 stm32.12 ; 45.09,49.53 40.26,49.53 39.62,50.17 35.55,50.17 HC05.2
PA3: length 61.7
  Top Layer w0.254: HC05.3 35.59,47.59 42.53,47.59 43.81,46.3 43.81,42.29 46.92,39.19 67.09,39.19 71.75,34.52 71.75,33.63 stm32.13 ; ECB01C.2 51.04,50.17 v2(48.9,50.17)
  Bottom Layer w0.254: HC05.3 35.55,47.62 37.21,47.62 39.75,50.17 v2(48.9,50.17)
PA9: length 40.6
  Top Layer w0.254: v2(67.69,29.59) 64.72,29.59 stm32.30
  Bottom Layer w0.254: v2(67.69,29.59) 69.6,27.69 69.6,21.34 72.14,18.8 72.14,3.94 70.99,2.79 67.18,2.79 66.04,3.94 66.04,4.19 66.06,4.21 CN2.6
PA10: length 34.9
  Top Layer w0.254: v2(66.93,28.96) 66.04,28.96 65.91,29.08 64.72,29.08 stm32.31
  Bottom Layer w0.254: CN2.4 68.06,4.84 68.71,4.19 70.87,4.19 71.75,5.08 71.75,18.54 69.22,21.08 69.22,27.05 67.31,28.96 v2(66.93,28.96)
PA13: length 21.1
  Top Layer w0.254: stm32.34 64.73,27.6 66.66,27.6 66.93,27.33 v2(66.93,27.18)
  Bottom Layer w0.254: v2(66.93,27.18) 68.06,26.05 CN2.3
PA14: length 17.8
  Top Layer w0.254: stm32.37 66.02,24.89 v2(65.15,24.89)
  Bottom Layer w0.254: v2(65.15,24.89) 64.64,24.38 64.64,10.41 CN2.5
PB6: length 117.1
  Top Layer w0.254: v2(28.32,34.92) 28.32,37.21 26.92,38.61 18.29,38.61 17.78,39.12 17.78,41.78 18.8,42.8 26.03,42.8 29.84,46.61 29.84,48.02 WS2812.4 ; v2(62.1,21.46) 67.06,21.46 68.71,23.12 stm32.42
  Bottom Layer w0.254: v2(28.32,34.92) 24,34.92 21.97,32.89 21.97,25.02 23.24,23.75 26.54,23.75 32.93,17.36 44.13,17.36 47.4,20.63 52.76,20.63 54.48,22.35 58.8,22.35 59.18,21.97 59.18,15.88 60.07,14.99 61.09,14.99 61.72,15.62 61.72,21.08 v2(62.1,21.46)
PB8: length 70.6
  Top Layer w0.254: TB6612.15 26.14,13.84 39.12,13.84 41.02,11.94 42.94,11.94 42.98,11.98 50.21,11.98 52.58,14.35 60.32,14.35 61.2,15.23 61.2,16.76 ; 61.2,16.76 64.01,16.76 70.21,22.97 stm32.45 ; 61.2,16.76 61.2,17.71 57.75,21.16 57.75,21.18 57.21,21.72 56.28,21.72 53.68,19.11 49.46,19.11 49.01,18.66 U7.15
PB9: length 70.7
  Top Layer w0.254: v2(30.73,21.84) 35.31,17.27 38.1,17.27 39.12,18.29 39.12,20.45 40.13,21.46 42.16,21.46 42.93,20.7 42.93,19.81 43.81,18.93 43.81,16.51 v2(43.31,16) ; v2(52.96,13.21) 61.09,13.21 68.6,20.73 69.75,20.73 70.71,21.69 stm32.46
  Bottom Layer w0.254: v2(30.73,21.84) 27.94,24.64 27.94,29.21 26.92,30.23 TB6612.9 ; v2(43.31,16) 43.31,14.86 44.96,13.21 v2(52.96,13.21)
$1N4253: length 29.3
  Top Layer w1: D1.1 77.39,9.14 F1.2 80.09,11.21 C1.2 83.57,15.13 83.57,20.19 92.96,29.59 SW1.2
$1N5616: length 5
  Top Layer w0.254: Q1.1 11.87,52 R18.2 11.8,52.85 R17.2
$1N5651: length 13.3
  Top Layer w0.508: Q1.3 13.53,48.02 BUZ1.2 15.55,55.89 D2.2
$2N1115: length 1.9
  Top Layer w0.254: PWR1.2 81.4,46.66 R1.1
$2N2795: length 2
  Top Layer w0.254: LED1.2 64,18.41 R9.2
$3N1988: length 2.4
  Top Layer w0.254: Motor1.4 27.44,5.62 R10.1
$3N1994: length 2.4
  Top Layer w0.254: Motor1.3 24.78,7.46 R11.1
$3N2076: length 2.4
  Top Layer w0.254: Motor2.4 49.54,5.62 R12.1
$3N2080: length 2.5
  Top Layer w0.254: R13.1 46.88,7.34 Motor2.3
$4N663: length 3
  Top Layer w0.254: C21.1 52.41,30 U8.10
$4N779: length 1.9
  Top Layer w0.254: U8.20 46.48,30.48 45.47,30.48 44.96,30.99 C22.1
$5N309: length 2.9
  Top Layer w0.254: ECB01C.4 51.06,47.4 49.89,47.4 49.02,48.26 R16.2
$5N416: length 1.8
  Top Layer w0.254: R16.1 47.13,46.51 LED2.2
$5N543: length 5.5
  Top Layer w0.254: ECB01C.5 60.25,47.5 X2.1
$5N549: length 7.6
  Top Layer w0.254: ECB01C.6 56.66,48.89 62.81,48.89 63.71,47.99
$5N941: length 1.6
  Top Layer w0.584: 56.53,52.93 ECB01C.8

## Copper pours and planes (outline as drawn; the poured copper is in the pictures)
GND on Top Layer: -2.64,62.48 100.63,62.48 100.63,-2.29 -2.64,-2.29
GND on Bottom Layer: -5.33,65.28 102.26,65.28 102.26,-4.42 -5.33,-4.42

Small or netless copper shapes (teardrops, artwork), in the pictures only: 311 on Top Layer, 121 on Bottom Layer

## Text on the board
Top Silkscreen Layer: U1TX | CLK | U1RX | DIO | GND | 5V | 3V3 | RST | SCL | SDA | slave | スレイブ
